# Altium project 手机滚压测试运动控制板.PrjPCB
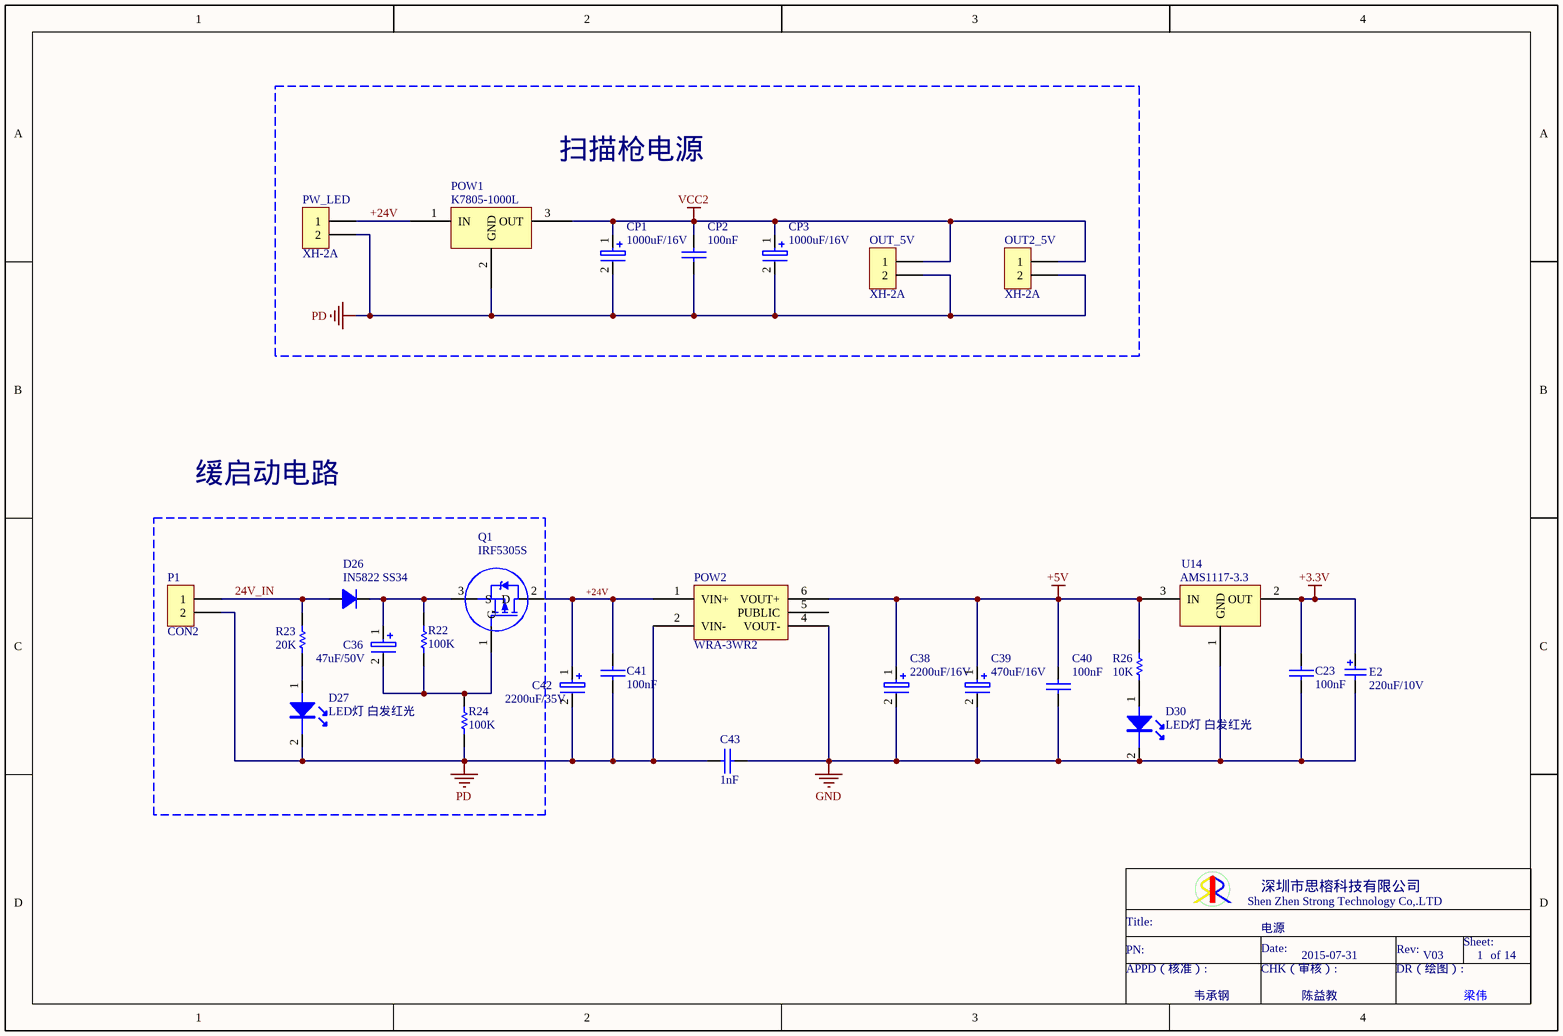
[diagram p0: 01_POWER.SchDoc]
14 sheets, 390 parts. Net scope: global (net labels, ports and power ports of the same name join across sheets).
Board file: 手机滚压测试夹具.PcbDoc
Sheets:
  01_POWER.SchDoc
  02_MCU.SchDoc
  03_USART.SchDoc
  04_SCAN.SchDoc
  05_SD_USB.SchDoc
  06_SENSOR.SchDoc
  07_MOTOR.SchDoc
  08_DC_DC.SchDoc
  09_AD.SchDoc
  10_AD1.SchDoc
  11_INPUT.SchDoc
  12_OUT.SchDoc
  13_EEPROM_SW_JTAG.SchDoc
  14_CONNECTOR.SchDoc

## Sheet 01_POWER.SchDoc
size A4; Date: 2015-08-03; PageSetup: Record=PageOptions|CenterHorizontal=True|CenterVertical=True|PrintScale=0.97|XCorrection=1.00|YCorrection=1.00|PrintKind=0|BorderSize=5000000|LeftOffset=0|BottomOffset=0|Orientation=2|PaperLength=1000|PaperWidth=1000|Scale=100|PaperSource=7|PrintQuality=-4|MediaType=1|DitherType=10|PaperKind=A4|PrintScaleMode=1

### Parts
C23  100nF  [0603C]
C36  47uF/50V  [RB6.3*11]
C38  2200uF/16V  [RB10*20]
C39  470uF/16V  [RB8*11.5]
C40  100nF  [0805C]
C41  100nF  [0805C]
C42  2200uF/35V  [RB16*25]
C43  1nF  [1206C]
CP1  1000uF/16V  [RB8*11.5]
CP2  100nF  [0805C]
CP3  1000uF/16V  [RB8*11.5]
D26  IN5822 SS34  [DO-214AA]
D27  LED灯 白发红光  [D0603]
D30  LED灯 白发红光  [D0603]
E2  220uF/10V  [6032]
OUT2_5V  XH-2A  [CN2-2.54]
OUT_5V  XH-2A  [CN2-2.54]
P1  CON2  [CON-2_5.08]
POW1  K7805-1000L  [K7805-1000L]
POW2  WRA-3WR2  [WRA-3WR2]
PW_LED  XH-2A  [CN2-2.54]
Q1  IRF5305S  [TO-252]
R22  100K  [0805R]
R23  20K  [0805R]
R24  100K  [0805R]
R26  10K  [0603R]
U14  AMS1117-3.3  [SOT223_CX1117]

### Blocks framed on the sheet
扫描枪电源: CP1-CP3 OUT2_5V OUT_5V POW1 PW_LED

### Nets
+3.3V: C23.2 E2.1 U14.2(OUT)
+5V: C38.1 C39.1 C40.1 POW2.6(VOUT+) R26.2 U14.3(IN)
+24V: C41.1 C42.1 POW1.1(IN) POW2.1(VIN+) PW_LED.1 Q1.2(D)
GND: C23.1 C38.2 C39.2 C40.2 C43.2 D30.2 E2.2 POW2.4(VOUT-) U14.1(GND)
PD: C41.2 C42.2 C43.1 CP1.2 CP2.2 CP3.2 D27.2 OUT2_5V.2 OUT_5V.2 P1.2 POW1.2(GND) POW2.2(VIN-) PW_LED.2 R24.1
VCC2: CP1.1 CP2.1 CP3.1 OUT2_5V.1 OUT_5V.1 POW1.3(OUT)
24V_IN: D26.1 P1.1 R23.2
NetC36_1: C36.1 D26.2 Q1.3(S) R22.2
NetC36_2: C36.2 Q1.1(G) R22.1 R24.2
NetD27_1: D27.1 R23.1
NetD30_1: D30.1 R26.1

Not connected (* = marked no-connect by the designer): POW2 5(PUBLIC)

### Notes on the sheet
- 缓启动电路
- 电源
- 2015-07-31
- V03
- 1
- 14
- 韦承钢
- 陈益教
- Shen Zhen Strong Technology Co,.LTD
- 深圳市思榕科技有限公司
- Title:
- PN:
- APPD（核准）:
- Date:
- CHK（审核）:
- DR（绘图）:
- Rev:
- Sheet:
- of
- 梁伟

### Library data of the parts
C23 = CAP
C36 C38 C39 C42 CP1 CP3 = CAP2: 电解电容器
C40 C41 C43 CP2 = CAP: Capacitor
D26 = DIODE-D
D27 D30 = LED: LED灯
E2 = 电解电容: Bi-Polar Capacitor; Value: 220uF/10V
OUT2_5V OUT_5V PW_LED = CON2
POW2 = Component_1
Q1 = MOSFET-P: P型MOSFET
R22-R24 R26 = RES
U14 = CX1117

## Sheet 02_MCU.SchDoc
size A4; PageSetup: Record=PageOptions|CenterHorizontal=True|CenterVertical=True|PrintScale=0.97|XCorrection=1.00|YCorrection=1.00|PrintKind=0|BorderSize=5000000|LeftOffset=0|BottomOffset=0|Orientation=2|PaperLength=1000|PaperWidth=1000|Scale=100|PaperSource=7|PrintQuality=-4|MediaType=1|DitherType=10|PaperKind=A4|PrintScaleMode=1; DATA: 2015-08-03
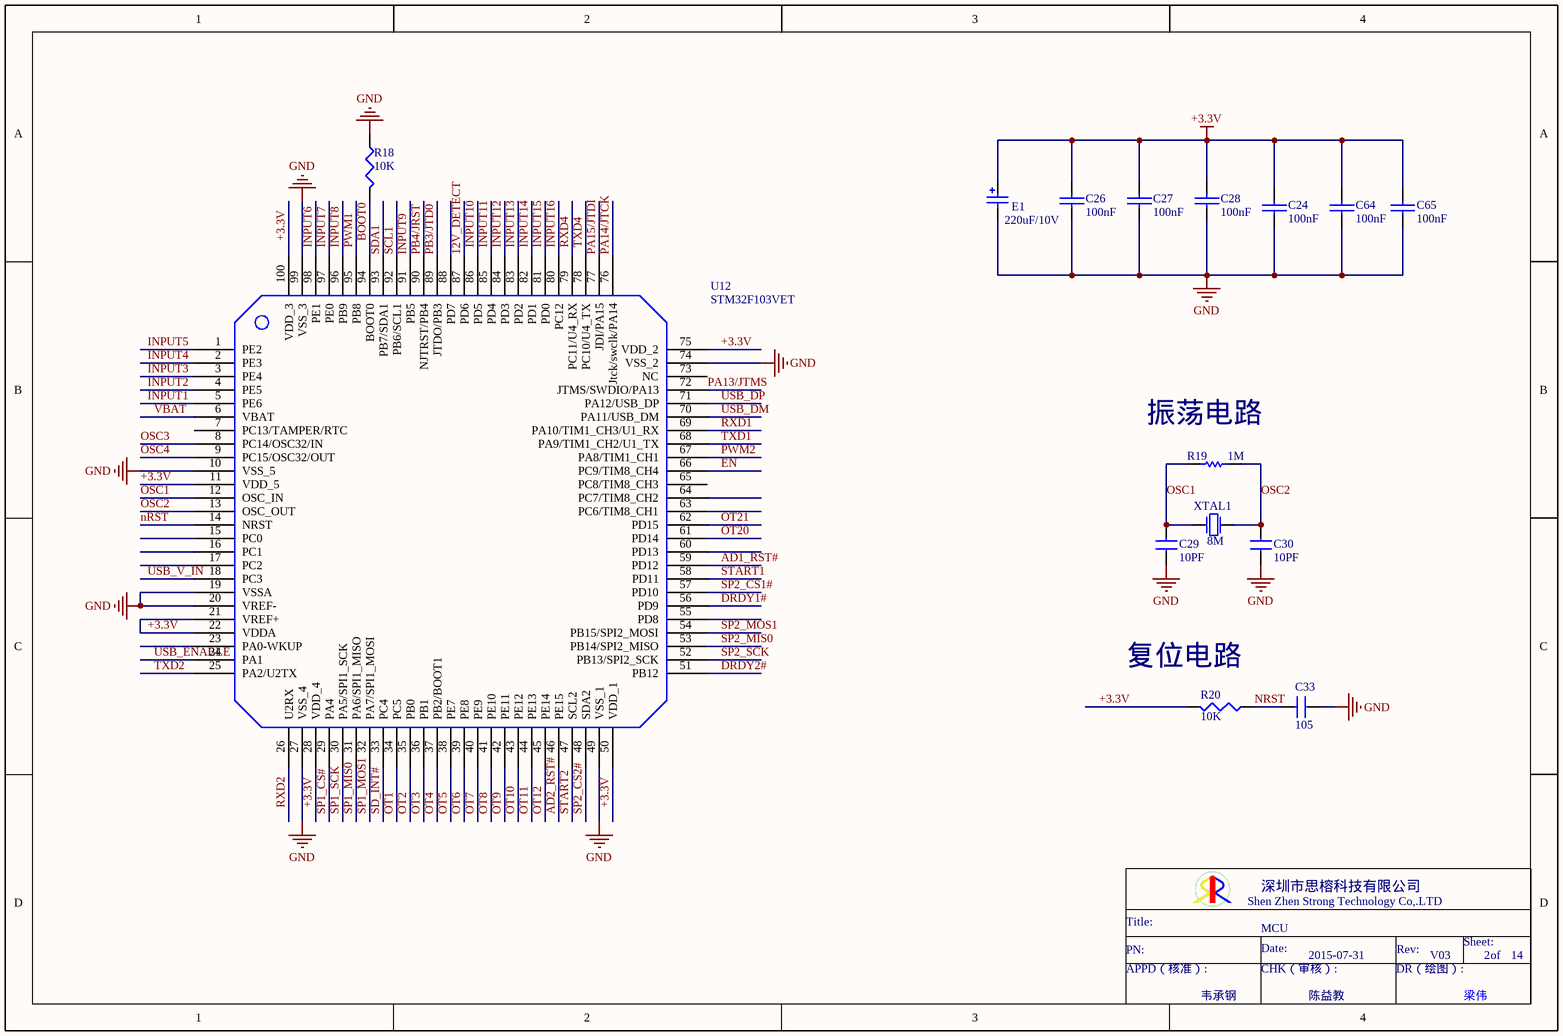
[diagram p1: 02_MCU.SchDoc]

### Parts
C24  100nF  [0603C]
C26  100nF  [0603C]
C27  100nF  [0603C]
C28  100nF  [0603C]
C29  10PF  [0603C]
C30  10PF  [0603C]
C33  value 105  [0603C]  (hidden comment: 100nF)
C64  100nF  [0603C]
C65  100nF  [0603C]
E1  220uF/10V  [6032]
R18  10K  [0603R]
R19  1M  [0603R]
R20  10K  [0603R]
U12  STM32F103VET  [LQFP100]
XTAL1  8M  [CRYL3*5]

### Nets
+3.3V: C24.2 C26.2 C27.2 C28.2 C64.2 C65.2 E1.1 R20.2 U12.11(VDD_5) U12.21(VREF+) U12.22(VDDA) U12.28(VDD_4) U12.50(VDD_1) U12.75(VDD_2) U12.100(VDD_3)
GND: C24.1 C26.1 C27.1 C28.1 C29.1 C30.1 C33.2 C64.1 C65.1 E1.2 R18.1 U12.10(VSS_5) U12.19(VSSA) U12.20(VREF-) U12.27(VSS_4) U12.49(VSS_1) U12.74(VSS_2) U12.99(VSS_3)
12V_DETECT: U12.87(PD6)
AD1_RST#: U12.59(PD12)
AD2_RST#: U12.46(PE15)
BOOT0: R18.2 U12.94(BOOT0)
DRDY1#: U12.56(PD9)
DRDY2#: U12.51(PB12)
EN: U12.66(PC9/TIM8_CH4)
INPUT1: U12.5(PE6)
INPUT2: U12.4(PE5)
INPUT3: U12.3(PE4)
INPUT4: U12.2(PE3)
INPUT5: U12.1(PE2)
INPUT6: U12.98(PE1)
INPUT7: U12.97(PE0)
INPUT8: U12.96(PB9)
INPUT9: U12.91(PB5)
INPUT10: U12.86(PD5)
INPUT11: U12.85(PD4)
INPUT12: U12.84(PD3)
INPUT13: U12.83(PD2)
INPUT14: U12.82(PD1)
INPUT15: U12.81(PD0)
INPUT16: U12.80(PC12)
nRST: C33.1 R20.1 U12.14(NRST)
OSC1: C29.2 R19.2 U12.12(OSC_IN) XTAL1.1
OSC2: C30.2 R19.1 U12.13(OSC_OUT) XTAL1.2
OSC3: U12.8(PC14/OSC32/IN)
OSC4: U12.9(PC15/OSC32/OUT)
OT1: U12.34(PC5)
OT2: U12.35(PB0)
OT3: U12.36(PB1)
OT4: U12.37(PB2/BOOT1)
OT5: U12.38(PE7)
OT6: U12.39(PE8)
OT7: U12.40(PE9)
OT8: U12.41(PE10)
OT9: U12.42(PE11)
OT10: U12.43(PE12)
OT11: U12.44(PE13)
OT12: U12.45(PE14)
OT20: U12.61(PD14)
OT21: U12.62(PD15)
PA13/JTMS: U12.72(JTMS/SWDIO/PA13)
PA14/JTCK: U12.76(Jtck/swclk/PA14)
PA15/JTDI: U12.77(JDI/PA15)
PB3/JTD0: U12.89(JTDO/PB3)
PB4/JRST: U12.90(NJTRST/PB4)
PWM1: U12.95(PB8)
PWM2: U12.67(PA8/TIM1_CH1)
RXD1: U12.69(PA10/TIM1_CH3/U1_RX)
RXD2: U12.26(U2RX)
RXD4: U12.79(PC11/U4_RX)
SCL1: U12.92(PB6/SCL1)
SD_INT#: U12.33(PC4)
SDA1: U12.93(PB7/SDA1)
SP1_CS#: U12.29(PA4)
SP1_MIS0: U12.31(PA6/SPI1_MISO)
SP1_MOS1: U12.32(PA7/SPI1_MOSI)
SP1_SCK: U12.30(PA5/SPI1_SCK)
SP2_CS1#: U12.57(PD10)
SP2_CS2#: U12.48(SDA2)
SP2_MIS0: U12.53(PB14/SPI2_MISO)
SP2_MOS1: U12.54(PB15/SPI2_MOSI)
SP2_SCK: U12.52(PB13/SPI2_SCK)
START1: U12.58(PD11)
START2: U12.47(SCL2)
TXD1: U12.68(PA9/TIM1_CH2/U1_TX)
TXD2: U12.25(PA2/U2TX)
TXD4: U12.78(PC10/U4_TX)
USB_DM: U12.70(PA11/USB_DM)
USB_DP: U12.71(PA12/USB_DP)
USB_ENABLE: U12.24(PA1)
USB_V_IN: U12.18(PC3)
VBAT: U12.6(VBAT)

Not connected (* = marked no-connect by the designer): U12 7(PC13/TAMPER/RTC) 15(PC0) 16(PC1) 17(PC2) 23(PA0-WKUP) 55(PD8) 60(PD13) 63(PC6/TIM8_CH1) 64(PC7/TIM8_CH2) 65(PC8/TIM8_CH3) 73(NC) 88(PD7)

### Notes on the sheet
- (near R19) 振荡电路
- (near R20) 复位电路
- MCU
- 2015-07-31
- V03
- 2
- 14
- 韦承钢
- 陈益教
- Shen Zhen Strong Technology Co,.LTD
- 深圳市思榕科技有限公司
- Title:
- PN:
- APPD（核准）:
- Date:
- CHK（审核）:
- DR（绘图）:
- Rev:
- Sheet:
- of
- 梁伟

### Library data of the parts
C24 C26-C28 C64 C65 = CAP
C29 C30 C33 = 电容: Capacitor
  C29 C30: Value: 10PF
E1 = 电解电容: Bi-Polar Capacitor; Value: 220uF/10V
R18 R20 = RES1
R19 = RES
U12 = STM32F103VET_1
XTAL1 = 晶振: CRYSTAL

## Sheet 03_USART.SchDoc
size A4; PageSetup: Record=PageOptions|CenterHorizontal=True|CenterVertical=True|PrintScale=0.97|XCorrection=1.00|YCorrection=1.00|PrintKind=0|BorderSize=5000000|LeftOffset=0|BottomOffset=0|Orientation=2|PaperLength=1000|PaperWidth=1000|Scale=100|PaperSource=7|PrintQuality=-4|MediaType=1|DitherType=10|PaperKind=A4|PrintScaleMode=1
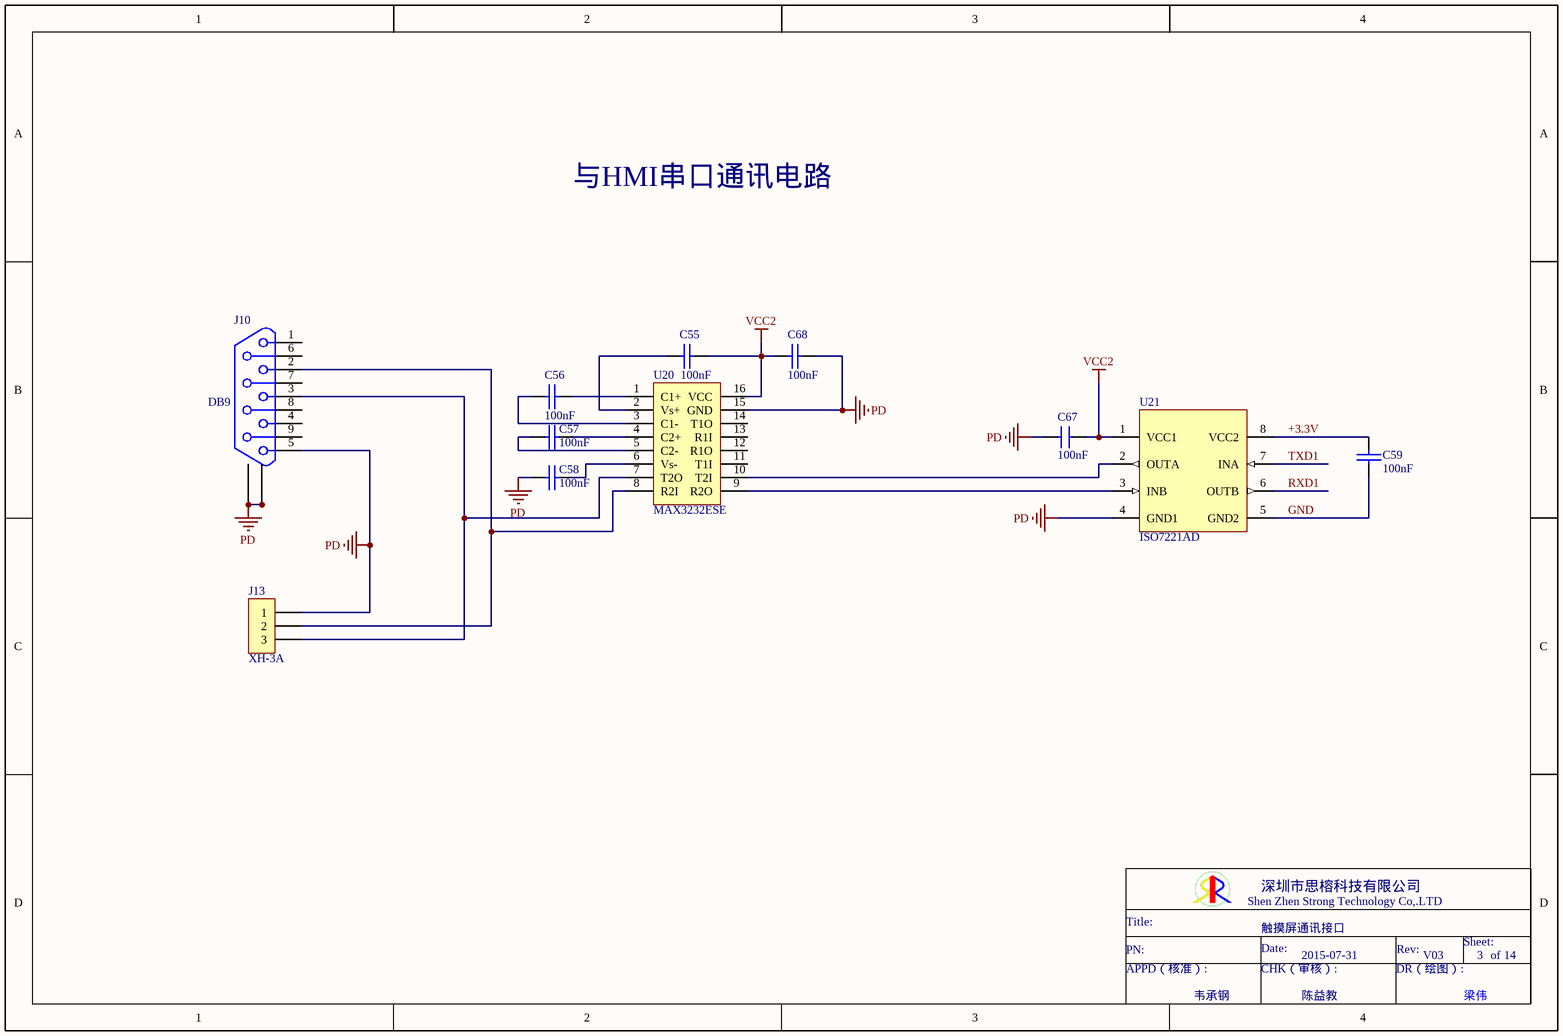
[diagram p2: 03_USART.SchDoc]

### Parts
C55  100nF  [0603C]
C56  100nF  [0603C]
C57  100nF  [0603C]
C58  100nF  [0603C]
C59  100nF  [0603C]
C67  100nF  [0603C]
C68  100nF  [0603C]
J10  DB9  [DSUB1.385]
J13  XH-3A  [CN3-2.54]
U20  MAX3232ESE  [SO-16]
U21  ISO7221AD  [SOP8]

### Nets
+3.3V: C59.2 U21.8(VCC2)
GND: C59.1 U21.5(GND2)
PD: C58.1 C67.1 C68.1 J10.5 J10.10 J10.11 J13.1 U20.15(GND) U21.4(GND1)
VCC2: C55.2 C67.2 C68.2 U20.16(VCC) U21.1(VCC1)
RXD1: U21.6(OUTB)
TXD1: U21.7(INA)
NetC55_1: C55.1 U20.2(Vs+)
NetC56_1: C56.1 U20.1(C1+)
NetC56_2: C56.2 U20.3(C1-)
NetC57_1: C57.1 U20.5(C2-)
NetC57_2: C57.2 U20.4(C2+)
NetC58_2: C58.2 U20.6(Vs-)
NetJ10_2: J10.2 J13.2 U20.8(R2I)
NetJ10_3: J10.3 J13.3 U20.7(T2O)
NetU20_9: U20.9(R2O) U21.3(INB)
NetU20_10: U20.10(T2I) U21.2(OUTA)

Not connected (* = marked no-connect by the designer): J10 1 4 6 7 8 9; U20 11(T1I) 12(R1O) 13(R1I) 14(T1O)

### Notes on the sheet
- 与HMI串口通讯电路
- 触摸屏通讯接口
- 2015-07-31
- V03
- 3
- 14
- 韦承钢
- 陈益教
- Shen Zhen Strong Technology Co,.LTD
- 深圳市思榕科技有限公司
- Title:
- PN:
- APPD（核准）:
- Date:
- CHK（审核）:
- DR（绘图）:
- Rev:
- Sheet:
- of
- 梁伟

### Library data of the parts
C55-C59 C68 = CAP
C67 = 电容: Capacitor; C318: 100NF
J13 = CON3
U20 = MAX232
U21 = Component_1

## Sheet 04_SCAN.SchDoc
size A4; PageSetup: Record=PageOptions|CenterHorizontal=True|CenterVertical=True|PrintScale=0.97|XCorrection=1.00|YCorrection=1.00|PrintKind=0|BorderSize=5000000|LeftOffset=0|BottomOffset=0|Orientation=2|PaperLength=1000|PaperWidth=1000|Scale=100|PaperSource=7|PrintQuality=-4|MediaType=1|DitherType=10|PaperKind=A4|PrintScaleMode=1
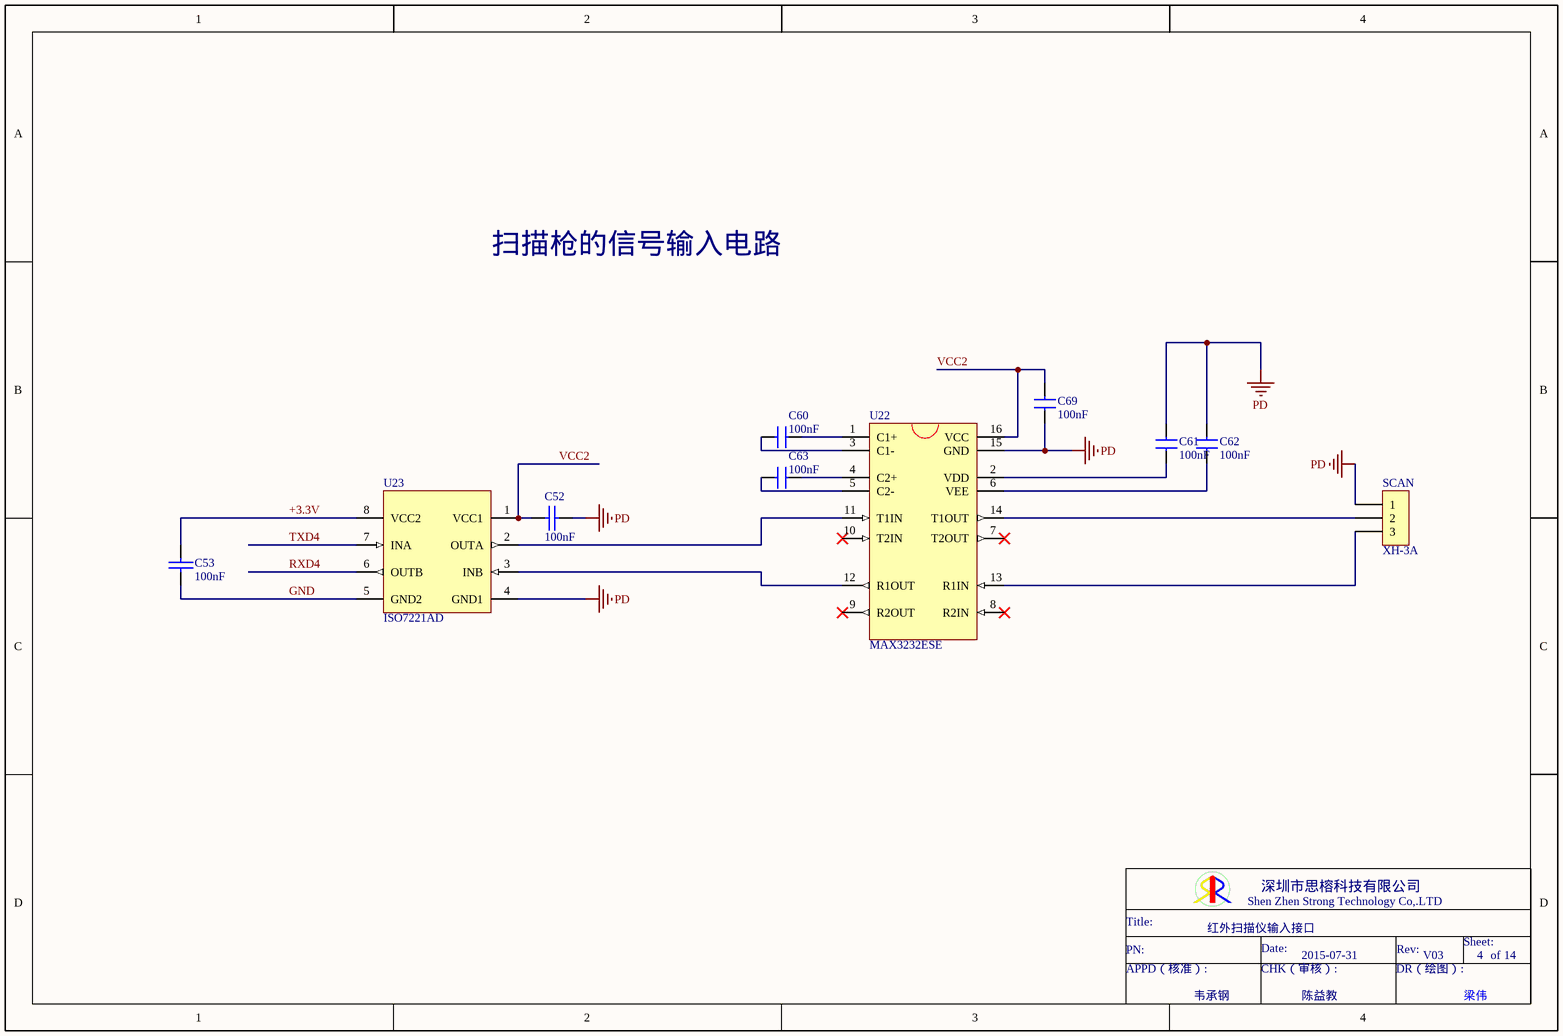
[diagram p3: 04_SCAN.SchDoc]

### Parts
C52  100nF  [0603C]
C53  100nF  [0603C]
C60  100nF  [0603C]
C61  100nF  [0603C]
C62  100nF  [0603C]
C63  100nF  [0603C]
C69  100nF  [0603C]
SCAN  XH-3A  [CN3-2.54]
U22  MAX3232ESE  [SOP16]
U23  ISO7221AD  [SOP8]

### Nets
+3.3V: C53.2 U23.8(VCC2)
GND: C53.1 U23.5(GND2)
PD: C52.2 C61.2 C62.2 C69.2 SCAN.1 U22.15(GND) U23.4(GND1)
VCC2: C52.1 C69.1 U22.16(VCC) U23.1(VCC1)
RXD4: U23.6(OUTB)
TXD4: U23.7(INA)
NetC60_1: C60.1 U22.3(C1-)
NetC60_2: C60.2 U22.1(C1+)
NetC61_1: C61.1 U22.2(VDD)
NetC62_1: C62.1 U22.6(VEE)
NetC63_1: C63.1 U22.4(C2+)
NetC63_2: C63.2 U22.5(C2-)
NetSCAN_2: SCAN.2 U22.14(T1OUT)
NetSCAN_3: SCAN.3 U22.13(R1IN)
NetU22_11: U22.11(T1IN) U23.2(OUTA)
NetU22_12: U22.12(R1OUT) U23.3(INB)

Not connected (* = marked no-connect by the designer): U22 7(T2OUT)* 8(R2IN)* 9(R2OUT)* 10(T2IN)*

### Notes on the sheet
- 扫描枪的信号输入电路
- 红外扫描仪输入接口
- 2015-07-31
- V03
- 4
- 14
- 韦承钢
- 陈益教
- Shen Zhen Strong Technology Co,.LTD
- 深圳市思榕科技有限公司
- Title:
- PN:
- APPD（核准）:
- Date:
- CHK（审核）:
- DR（绘图）:
- Rev:
- Sheet:
- of
- 梁伟

### Library data of the parts
C52 C53 = CAP
C60-C63 C69 = 电容: Capacitor
  C60: C316: 100NF
  C61: C319: 100NF
  C62: C320: 100NF
  C63: C317: 100NF
  C69: C318: 100NF
SCAN = CON3
U22 = U101: SP3232; Published: 8-Jun-2000; LatestRevisionDate: 29-May-2009; LatestRevisionNote: IPC-7351 Footprint Added.; PackageVersion: Aug-1999; PackageReference: SOT-23B; Publisher: Altium Limited; PackageDescription: 3-Pin SOT-23 Package 0.95 mm Pitch, 2.4 mm Lead Span
U23 = Component_1

## Sheet 05_SD_USB.SchDoc
size A4; PageSetup: Record=PageOptions|CenterHorizontal=True|CenterVertical=True|PrintScale=0.97|XCorrection=1.00|YCorrection=1.00|PrintKind=0|BorderSize=5000000|LeftOffset=0|BottomOffset=0|Orientation=2|PaperLength=1000|PaperWidth=1000|Scale=100|PaperSource=7|PrintQuality=-4|MediaType=1|DitherType=10|PaperKind=A4|PrintScaleMode=1
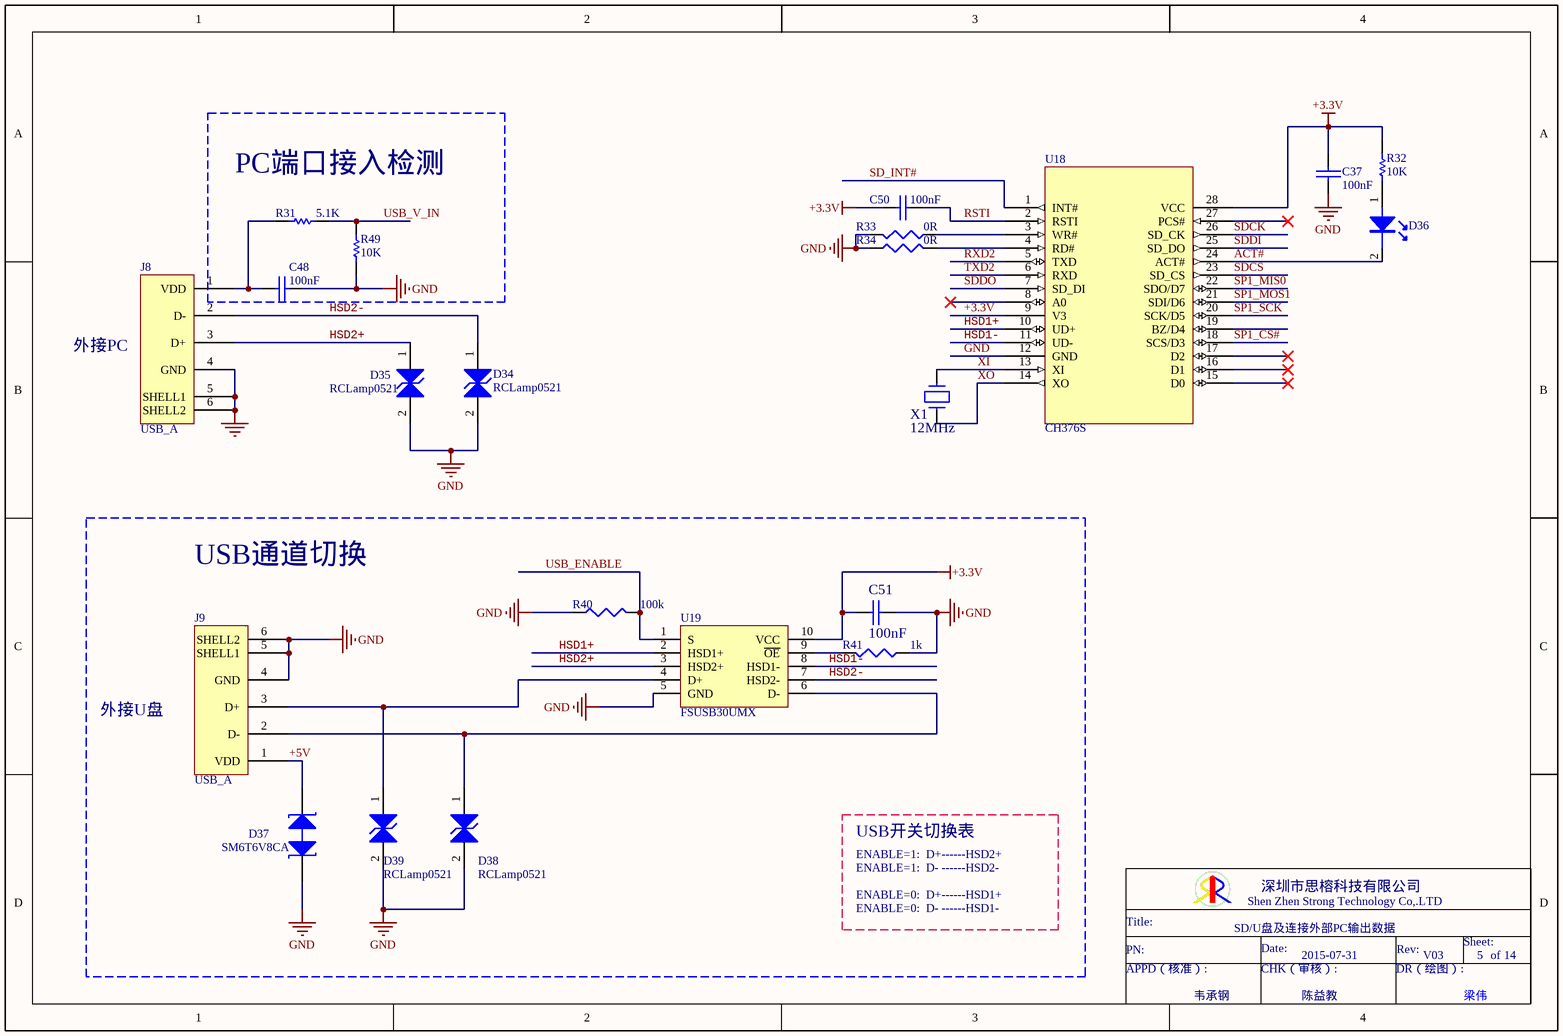
[diagram p4: 05_SD_USB.SchDoc]

### Parts
C37  100nF  [0603C]
C48  100nF  [0603C]
C50  100nF  [0603C]
C51  100nF  [0603C]
D34  RCLamp0521  [TVS]
D35  RCLamp0521  [TVS]
D36  LED灯 白发红光  [D0603]  (value not drawn)
D37  SM6T6V8CA  [DO-214AA]
D38  RCLamp0521  [TVS]
D39  RCLamp0521  [TVS]
J8  USB_A  [USB-AF]
J9  USB_A  [USB-AF]
R31  5.1K  [0603R]
R32  10K  [0603R]
R33  0R  [0603R]
R34  0R  [0603R]
R40  100k  [0603R]
R41  1k  [0603R]
R49  10K  [0603R]
U18  CH376S  [SOP28]
U19  FSUSB30UMX  [SSOP10]
X1  12MHz  [CRYL3*5]

### Blocks framed on the sheet
PC端口接入检测: C48 R31 R49
USB通道切换: C51 D37-D39 J9 R40 R41 U19

### Nets
+3.3V: C37.1 C50.1 C51.1 R32.2 U18.9(V3) U18.28(VCC) U19.10(VCC)
+5V: D37.2 J9.1(VDD)
GND: C37.2 C48.2 C51.2 D34.2 D35.2 D37.1 D38.2 D39.2 J8.4(GND) J8.5(SHELL1) J8.6(SHELL2) J9.4(GND) J9.5(SHELL1) J9.6(SHELL2) R33.2 R34.1 R40.1 R41.1 R49.2 U18.12(GND) U19.5(GND)
ACT#: D36.2 U18.24(ACT#)
HSD1+: U18.10(UD+) U19.2(HSD1+)
HSD1-: U18.11(UD-) U19.8(HSD1-)
HSD2+: D35.1 J8.3(D+) U19.3(HSD2+)
HSD2-: D34.1 J8.2(D-) U19.7(HSD2-)
RSTI: C50.2 U18.2(RSTI)
RXD2: U18.5(TXD)
SD_INT#: U18.1(INT#)
SDCK: U18.26(SD_CK)
SDCS: U18.23(SD_CS)
SDDI: U18.25(SD_DO)
SDDO: U18.7(SD_DI)
SP1_CS#: U18.18(SCS/D3)
SP1_MIS0: U18.22(SDO/D7)
SP1_MOS1: U18.21(SDI/D6)
SP1_SCK: U18.20(SCK/D5)
TXD2: U18.6(RXD)
USB_ENABLE: R40.2 U19.1(S)
USB_V_IN: R31.2 R49.1
XI: U18.13(XI) X1.1
XO: U18.14(XO) X1.2
NetC48_1: C48.1 J8.1(VDD) R31.1
NetD36_1: D36.1 R32.1
NetD38_1: D38.1 J9.2(D-) U19.6(D-)
NetD39_1: D39.1 J9.3(D+) U19.4(D+)
NetR33_1: R33.1 U18.3(WR#)
NetR34_2: R34.2 U18.4(RD#)
NetR41_2: R41.2 U19.9(~{OE})

Not connected (* = marked no-connect by the designer): U18 8(A0)* 15(D0)* 16(D1)* 17(D2)* 19(BZ/D4) 27(PCS#)*

### Notes on the sheet
- 外接PC
- 外接U盘
- USB开关切换表
- ENABLE=1:  D+------HSD2+
- ENABLE=1:  D- ------HSD2-
- ENABLE=0:  D+------HSD1+
- ENABLE=0:  D- ------HSD1-
- SD/U盘及连接外部PC输出数据
- 2015-07-31
- V03
- 5
- 14
- 韦承钢
- 陈益教
- Shen Zhen Strong Technology Co,.LTD
- 深圳市思榕科技有限公司
- Title:
- PN:
- APPD（核准）:
- Date:
- CHK（审核）:
- DR（绘图）:
- Rev:
- Sheet:
- of
- 梁伟

### Library data of the parts
C37 C48 C50 = CAP: Capacitor
C51 = Pro7B.tmp_0.01u_17
D34 D35 D38 D39 = TVS: RCLamp0521   SEMTECH; Published: 8-Jun-2000; LatestRevisionDate: 29-May-2009; LatestRevisionNote: IPC-7351 Footprint Added.; PackageVersion: Aug-1999; PackageReference: SOT-23B; Publisher: Altium Limited; PackageDescription: 3-Pin SOT-23 Package 0.95 mm Pitch, 2.4 mm Lead Span
D36 = LED: LED灯
D37 = TVS-1: SM6T6V8CA  ST; Published: 8-Jun-2000; LatestRevisionDate: 29-May-2009; LatestRevisionNote: IPC-7351 Footprint Added.; PackageVersion: Aug-1999; PackageReference: SOT-23B; Publisher: Altium Limited; PackageDescription: 3-Pin SOT-23 Package 0.95 mm Pitch, 2.4 mm Lead Span
J8 J9 = USB
R31 R32 R49 = RES
R33 = RES1: R1219: 0
R34 = RES1: R511: 0
R40 R41 = RES1
U18 = CH376S: USB Host and SD card Host with File System & USB Device for MCU, parallel / SPI / UART Serial
U19 = FSUSB30UMX_1: USB开关
X1 = Pro7B.tmp_12MHz_19

## Sheet 06_SENSOR.SchDoc
size A4; PageSetup: Record=PageOptions|CenterHorizontal=True|CenterVertical=True|PrintScale=0.97|XCorrection=1.00|YCorrection=1.00|PrintKind=0|BorderSize=5000000|LeftOffset=0|BottomOffset=0|Orientation=2|PaperLength=1000|PaperWidth=1000|Scale=100|PaperSource=7|PrintQuality=-4|MediaType=1|DitherType=10|PaperKind=A4|PrintScaleMode=1
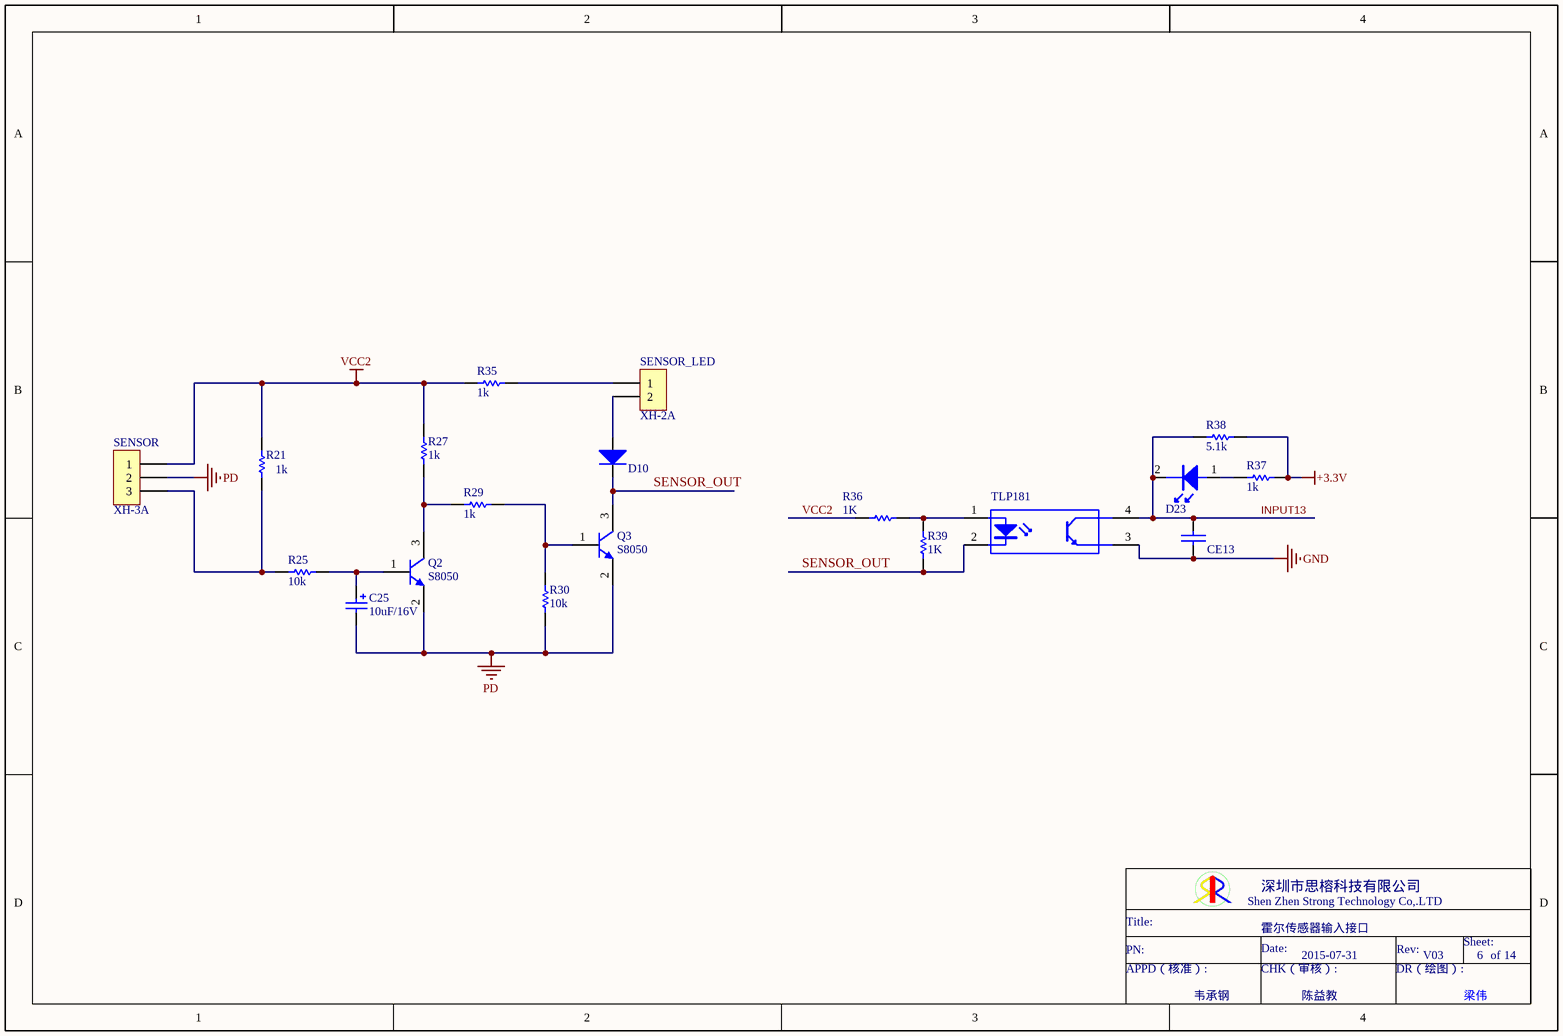
[diagram p5: 06_SENSOR.SchDoc]

### Parts
C25  10uF/16V  [A]
CE13  100pF  [0603C]  (value not drawn)
D10  IN4148W T4  [1206D]  (value not drawn)
D23  LED灯 白发红光  [D0603]  (value not drawn)
Q2  S8050  [SOT23]
Q3  S8050  [SOT23]
R21  1k  [0603R]
R25  10k  [0603R]
R27  1k  [0603R]
R29  1k  [0603R]
R30  10k  [0603R]
R35  1k  [0603R]
R36  1K  [0805R]
R37  1k  [0603R]
R38  5.1k  [0603R]
R39  1K  [0603R]
SENSOR  XH-3A  [CN3-2.54]
SENSOR_LED  XH-2A  [CN2-2.54]
U16  TLP181  [SOP4-2.54]

### Nets
+3.3V: R37.1 R38.1
GND: CE13.2 U16.3(E)
PD: C25.2 Q2.2(E) Q3.2(E) R30.1 SENSOR.2
VCC2: R21.1 R27.2 R35.1 R36.2 SENSOR.1
INPUT13: CE13.1 D23.2 R38.2 U16.4(C)
SENSOR_OUT: D10.2 Q3.3(C) R39.2 U16.2(K)
NetC25_1: C25.1 Q2.1(B) R25.1
NetD10_1: D10.1 SENSOR_LED.2
NetD23_1: D23.1 R37.2
NetQ2_3: Q2.3(C) R27.1 R29.2
NetQ3_1: Q3.1(B) R29.1 R30.2
NetR21_2: R21.2 R25.2 SENSOR.3
NetR35_2: R35.2 SENSOR_LED.1
NetR36_1: R36.1 R39.1 U16.1(A)

### Notes on the sheet
- 霍尔传感器输入接口
- 2015-07-31
- V03
- 6
- 14
- 韦承钢
- 陈益教
- Shen Zhen Strong Technology Co,.LTD
- 深圳市思榕科技有限公司
- Title:
- PN:
- APPD（核准）:
- Date:
- CHK（审核）:
- DR（绘图）:
- Rev:
- Sheet:
- of
- 梁伟

### Library data of the parts
C25 = Cap Pol2: Polarized Capacitor (Axial); Value: 100pF; Published: 8-Jun-2000; LatestRevisionDate: 17-Jul-2002; LatestRevisionNote: Re-released for DXP Platform.; PackageReference: POLAR0.8; Publisher: Altium Limited
CE13 = CAP: Capacitor
D10 = D: 二极管
D23 = LED: LED灯
Q2 Q3 = QNPN: NPN Bipolar Transistor; Published: 8-Jun-2000; LatestRevisionDate: 17-Jul-2002; LatestRevisionNote: Re-released for DXP Platform.; PackageReference: SOT-23B; Publisher: Altium Limited; Code_JEDEC: SOT-23
R21 R25 R27 R29 R30 R35-R39 = RES
SENSOR = CON3
SENSOR_LED = CON2
U16 = TLP521

## Sheet 07_MOTOR.SchDoc
size A4; PageSetup: Record=PageOptions|CenterHorizontal=True|CenterVertical=True|PrintScale=0.97|XCorrection=1.00|YCorrection=1.00|PrintKind=0|BorderSize=5000000|LeftOffset=0|BottomOffset=0|Orientation=2|PaperLength=1000|PaperWidth=1000|Scale=100|PaperSource=7|PrintQuality=-4|MediaType=1|DitherType=10|PaperKind=A4|PrintScaleMode=1
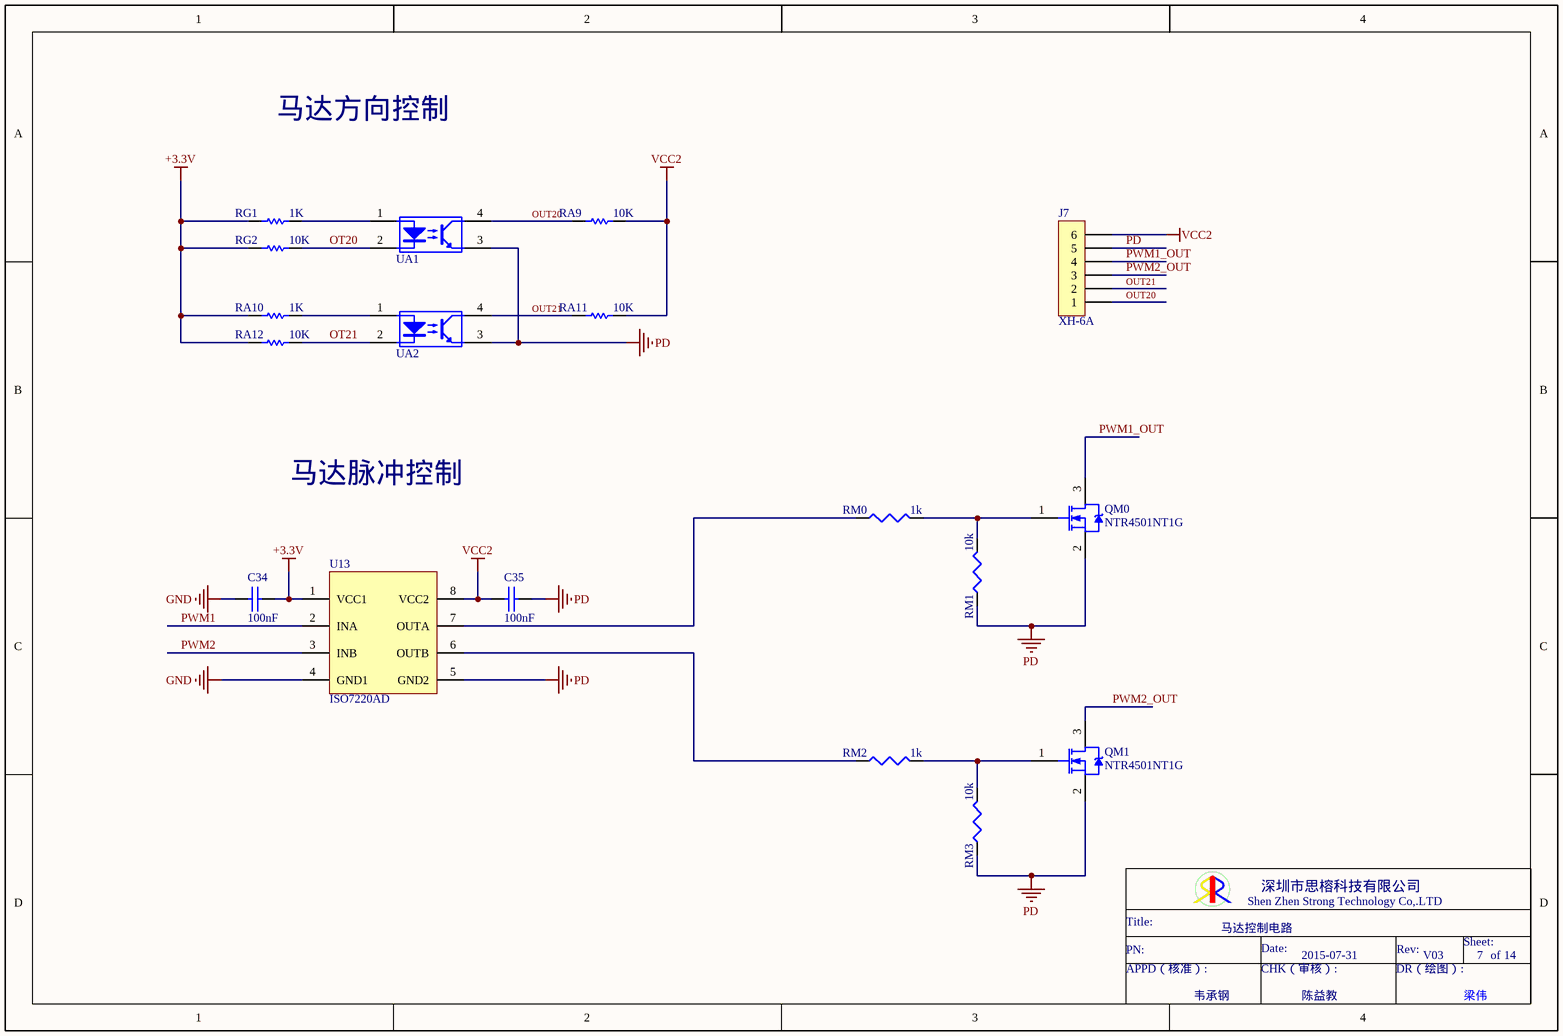
[diagram p6: 07_MOTOR.SchDoc]

### Parts
C34  100nF  [0603C]
C35  100nF  [0603C]
J7  XH-6A  [CN6-2.54]
QM0  NTR4501NT1G  [SOT23]
QM1  NTR4501NT1G  [SOT23]
RA9  10K  [0603R]
RA10  1K  [0603R]
RA11  10K  [0603R]
RA12  10K  [0603R]
RG1  1K  [0603R]
RG2  10K  [0603R]
RM0  1k  [0603R]
RM1  10k  [0603R]
RM2  1k  [0603R]
RM3  10k  [0603R]
U13  ISO7220AD  [SOP8]
UA1  AQY212GS  [SOP4-2.54]  (value not drawn)
UA2  AQY212GS  [SOP4-2.54]  (value not drawn)

### Nets
+3.3V: C34.2 RA10.1 RA12.1 RG1.1 RG2.1 U13.1(VCC1)
GND: C34.1 U13.4(GND1)
PD: C35.1 J7.5 QM0.2(S) QM1.2(S) RM1.1 RM3.1 U13.5(GND2) UA1.3(Emitter) UA2.3(Emitter)
VCC2: C35.2 J7.6 RA9.2 RA11.2 U13.8(VCC2)
OT20: RG2.2 UA1.2(LED_Cathode)
OT21: RA12.2 UA2.2(LED_Cathode)
OUT20: J7.1 RA9.1 UA1.4(Collector)
OUT21: J7.2 RA11.1 UA2.4(Collector)
PWM1: U13.2(INA)
PWM1_OUT: J7.4 QM0.3(D)
PWM2: U13.3(INB)
PWM2_OUT: J7.3 QM1.3(D)
NetQM0_1: QM0.1(G) RM0.2 RM1.2
NetQM1_1: QM1.1(G) RM2.2 RM3.2
NetRA10_2: RA10.2 UA2.1(LED_Anode)
NetRG1_2: RG1.2 UA1.1(LED_Anode)
NetRM0_1: RM0.1 U13.7(OUTA)
NetRM2_1: RM2.1 U13.6(OUTB)

### Notes on the sheet
- 马达方向控制
- 马达脉冲控制
- 马达控制电路
- 2015-07-31
- V03
- 7
- 14
- 韦承钢
- 陈益教
- Shen Zhen Strong Technology Co,.LTD
- 深圳市思榕科技有限公司
- Title:
- PN:
- APPD（核准）:
- Date:
- CHK（审核）:
- DR（绘图）:
- Rev:
- Sheet:
- of
- 梁伟

### Library data of the parts
C34 C35 = CAP
J7 = CON6: 单排
QM0 QM1 = MOSFET-N: MOSFET N沟道
RA9-RA12 RG1 RG2 = RES
RM0-RM3 = RES1
U13 = ISO7220: DUAL DIGITAL ISOLATOR
UA1 UA2 = TLP281

## Sheet 08_DC_DC.SchDoc
size A4; PageSetup: Record=PageOptions|CenterHorizontal=True|CenterVertical=True|PrintScale=0.97|XCorrection=1.00|YCorrection=1.00|PrintKind=0|BorderSize=5000000|LeftOffset=0|BottomOffset=0|Orientation=2|PaperLength=1000|PaperWidth=1000|Scale=100|PaperSource=7|PrintQuality=-4|MediaType=1|DitherType=10|PaperKind=A4|PrintScaleMode=1
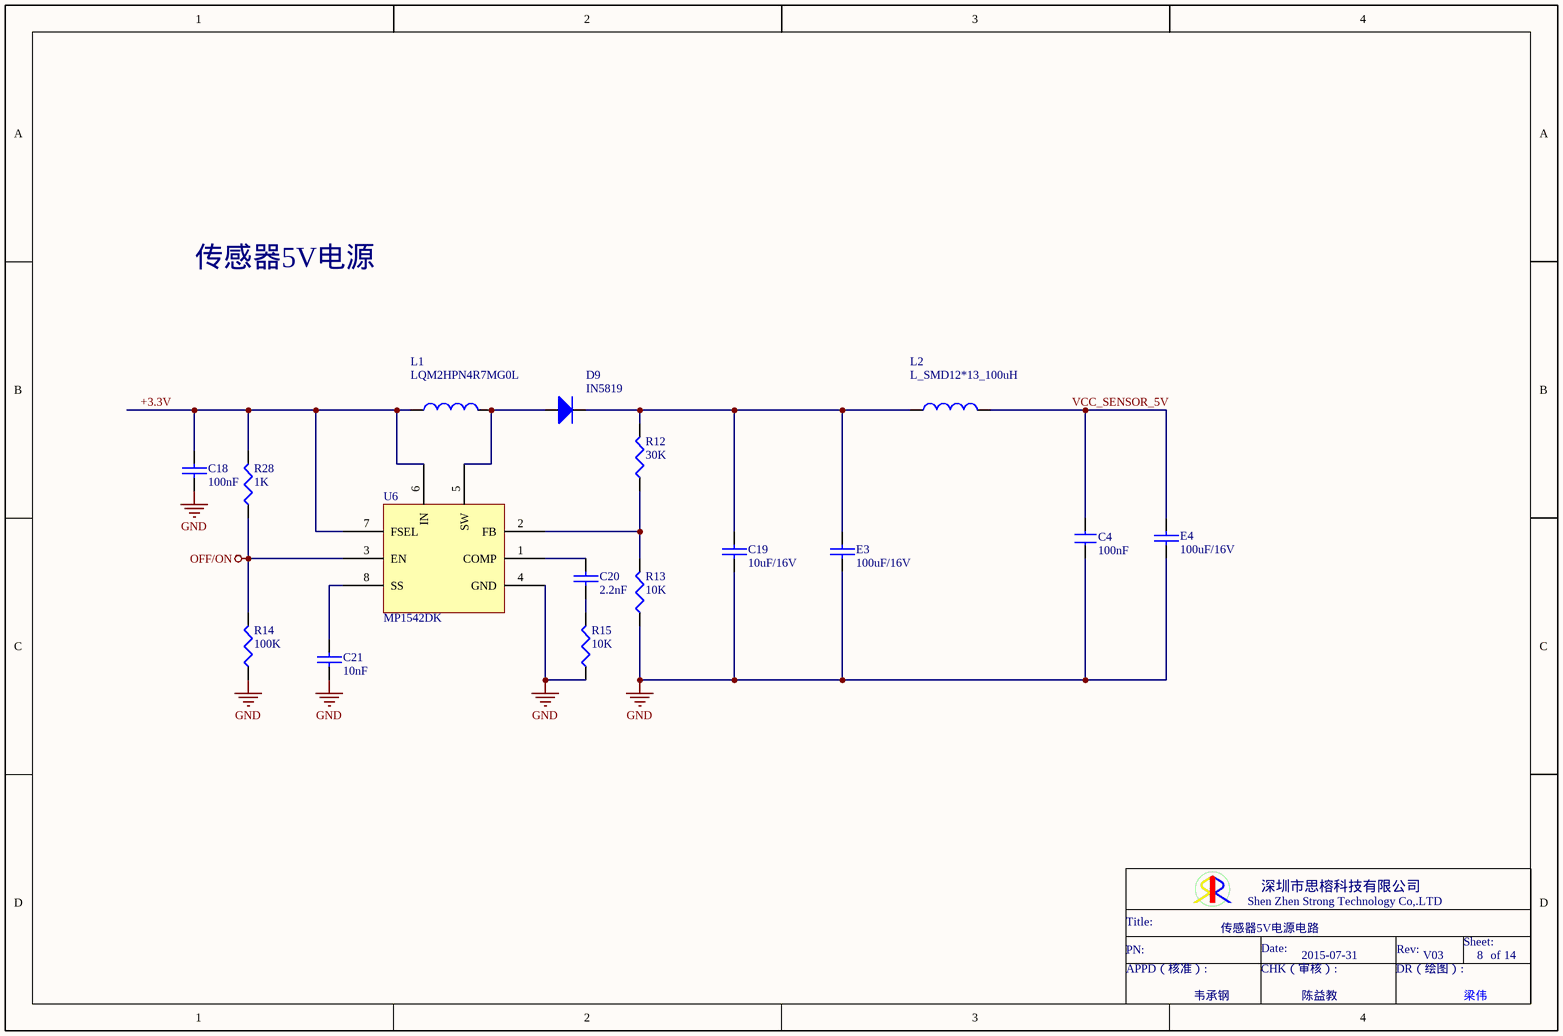
[diagram p7: 08_DC_DC.SchDoc]

### Parts
C4  100nF  [0603C]
C18  100nF  [0603C]
C19  10uF/16V  [A]
C20  2.2nF  [0603C]
C21  10nF  [0603C]
D9  IN5819  [1206D]
E3  100uF/16V  [6032]
E4  100uF/16V  [6032]
L1  LQM2HPN4R7MG0L  [3225]
L2  L_SMD12*13_100uH  [L-SMD12*13]
R12  30K  [0603R]
R13  10K  [0603R]
R14  100K  [0603R]
R15  10K  [0603R]
R28  1K  [0603R]
U6  MP1542DK  [SSOP8]

### Nets
+3.3V: C18.1 L1.1 R28.2 U6.6(IN) U6.7(FSEL)
GND: C4.2 C18.2 C19.2 C21.2 E3.2 E4.2 R13.1 R14.1 R15.1 U6.4(GND)
OFF/ON: R14.2 R28.1 U6.3(EN)
VCC_SENSOR_5V: C4.1 E4.1 L2.2
NetC19_1: C19.1 D9.2 E3.1 L2.1 R12.2
NetC20_1: C20.1 U6.1(COMP)
NetC20_2: C20.2 R15.2
NetC21_1: C21.1 U6.8(SS)
NetD9_1: D9.1 L1.2 U6.5(SW)
NetR12_1: R12.1 R13.2 U6.2(FB)

### Notes on the sheet
- 传感器5V电源
- 传感器5V电源电路
- 2015-07-31
- V03
- 8
- 14
- 韦承钢
- 陈益教
- Shen Zhen Strong Technology Co,.LTD
- 深圳市思榕科技有限公司
- Title:
- PN:
- APPD（核准）:
- Date:
- CHK（审核）:
- DR（绘图）:
- Rev:
- Sheet:
- of
- 梁伟

### Library data of the parts
C4 = 电容: Capacitor; Value: 100nF
C18-C21 E3 E4 = CAP: Capacitor
D9 = D: 二极管
L1 L2 = Inductor: Code_IEC: 1005; Value: 4.7uH; Published: 8-Jun-2000; LatestRevisionDate: 29-May-2009; LatestRevisionNote: IPC-7351 Footprint Added.; PackageReference: 0402-A; Publisher: Altium Limited; PackageDescription: Chip Inductor; Code_JEITA: 0402
R12-R15 R28 = RES1
U6 = MP1542DK: MPS公司产品   DC-DC控制IC; Published: 8-Jun-2000; LatestRevisionDate: 29-May-2009; LatestRevisionNote: IPC-7351 Footprint Added.; PackageVersion: Aug-1999; PackageReference: SOT-23B; Publisher: Altium Limited; PackageDescription: 3-Pin SOT-23 Package 0.95 mm Pitch, 2.4 mm Lead Span

## Sheet 09_AD.SchDoc
size A4; PageSetup: Record=PageOptions|CenterHorizontal=True|CenterVertical=True|PrintScale=0.97|XCorrection=1.00|YCorrection=1.00|PrintKind=0|BorderSize=5000000|LeftOffset=0|BottomOffset=0|Orientation=2|PaperLength=1000|PaperWidth=1000|Scale=100|PaperSource=7|PrintQuality=-4|MediaType=1|DitherType=10|PaperKind=A4|PrintScaleMode=1
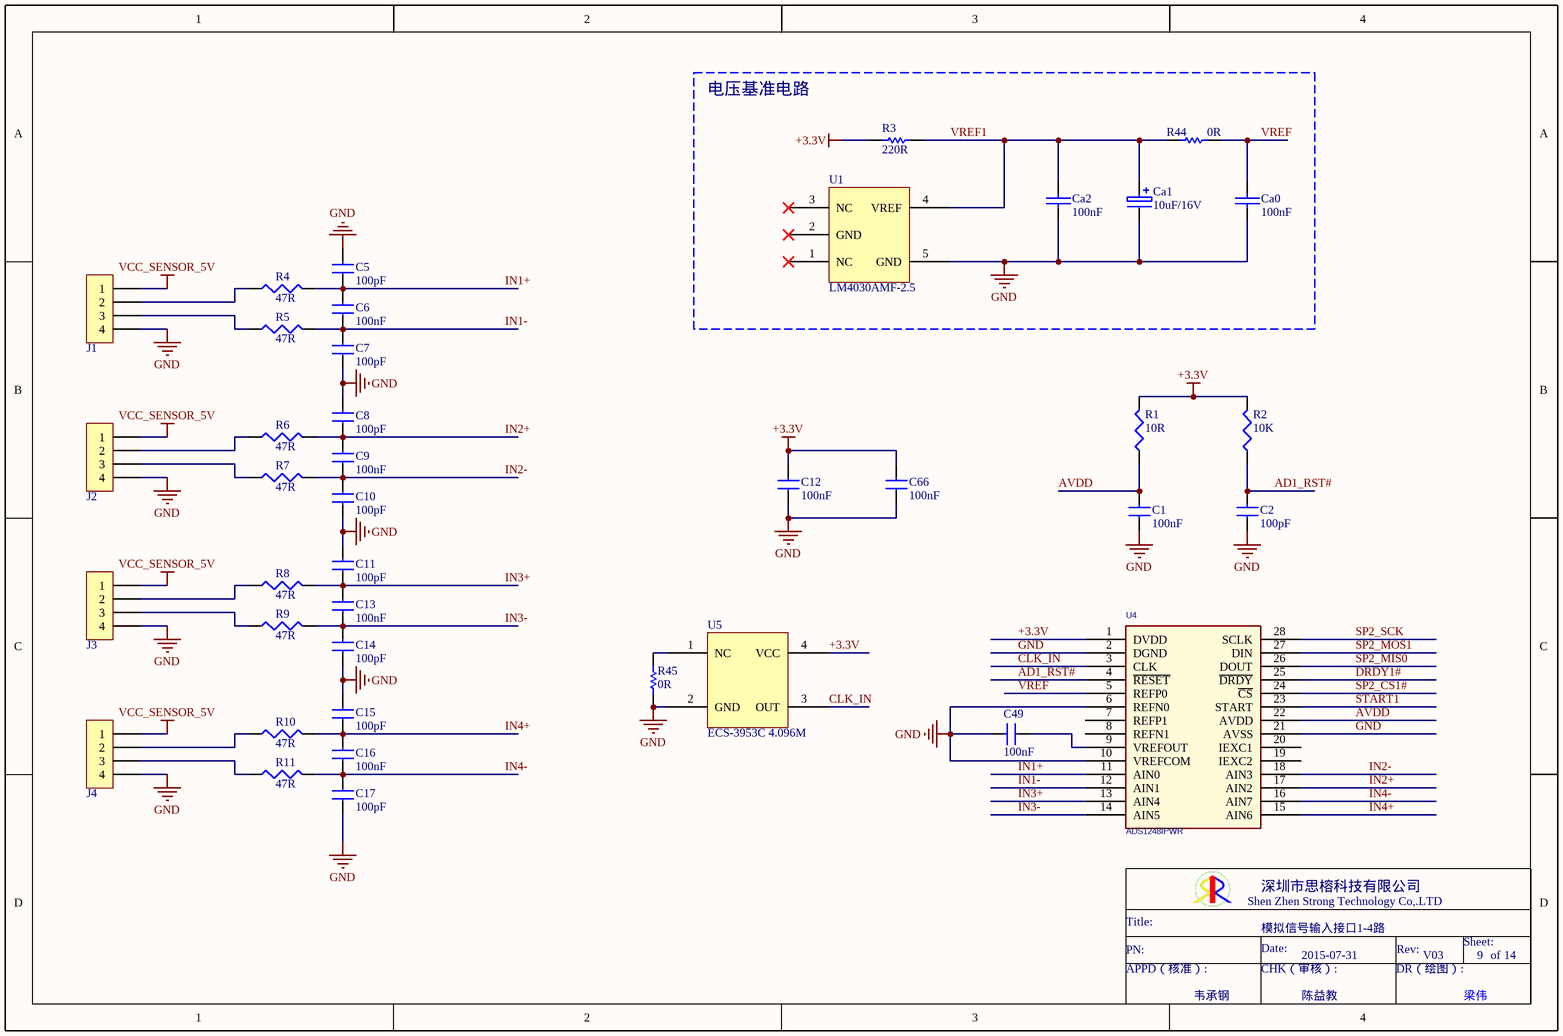
[diagram p8: 09_AD.SchDoc]

### Parts
C1  100nF  [0603C]
C2  100pF  [0603C]
C5  100pF  [0603C]
C6  100nF  [0603C]
C7  100pF  [0603C]
C8  100pF  [0603C]
C9  100nF  [0603C]
C10  100pF  [0603C]
C11  100pF  [0603C]
C12  100nF  [0603C]
C13  100nF  [0603C]
C14  100pF  [0603C]
C15  100pF  [0603C]
C16  100nF  [0603C]
C17  100pF  [0603C]
C49  100nF  [0603C]
C66  100nF  [0603C]
Ca0  100nF  [0603C]
Ca1  10uF/16V  [A]
Ca2  100nF  [0603C]
J1  XH-4A  [CN4-2.54]  (value not drawn)
J2  XH-4A  [CN4-2.54]  (value not drawn)
J3  XH-4A  [CN4-2.54]  (value not drawn)
J4  XH-4A  [CN4-2.54]  (value not drawn)
R1  10R  [0603R]
R2  10K  [0603R]
R3  220R  [0603R]
R4  47R  [0603R]
R5  47R  [0603R]
R6  47R  [0603R]
R7  47R  [0603R]
R8  47R  [0603R]
R9  47R  [0603R]
R10  47R  [0603R]
R11  47R  [0603R]
R44  0R  [0603R]
R45  0R  [0603R]
U1  LM4030AMF-2.5  [SOT23-5]
U4  ADS1248IPWR  [SOIC28]
U5  ECS-3953C 4.096M  [ECS-3953C]

### Blocks framed on the sheet
电压基准电路: Ca0-Ca2 R3 R44 U1

### Nets
+3.3V: C12.1 C66.2 R1.2 R2.2 R3.2 U4.1(DVDD) U5.4(VCC)
GND: C1.2 C2.2 C5.1 C7.2 C8.1 C10.2 C11.1 C12.2 C14.2 C15.1 C17.2 C49.2 C66.1 Ca0.2 Ca1.2 Ca2.2 J1.4 J2.4 J3.4 J4.4 R45.1 U1.5(GND) U4.2(DGND) U4.6(REFN0) U4.10(VREFCOM) U4.21(AVSS) U5.2(GND)
VCC_SENSOR_5V: J1.1 J2.1 J3.1 J4.1
AD1_RST#: C2.1 R2.1 U4.4(~{RESET})
AVDD: C1.1 R1.1 U4.22(AVDD)
CLK_IN: U4.3(CLK) U5.3(OUT)
DRDY1#: U4.25(~{DRDY})
IN1+: C5.2 C6.1 R4.2 U4.11(AIN0)
IN1-: C6.2 C7.1 R5.2 U4.12(AIN1)
IN2+: C8.2 C9.1 R6.2 U4.17(AIN2)
IN2-: C9.2 C10.1 R7.2 U4.18(AIN3)
IN3+: C11.2 C13.1 R8.2 U4.13(AIN4)
IN3-: C13.2 C14.1 R9.2 U4.14(AIN5)
IN4+: C15.2 C16.1 R10.2 U4.15(AIN6)
IN4-: C16.2 C17.1 R11.2 U4.16(AIN7)
SP2_CS1#: U4.24(~{CS})
SP2_MIS0: U4.26(DOUT)
SP2_MOS1: U4.27(DIN)
SP2_SCK: U4.28(SCLK)
START1: U4.23(START)
VREF: Ca0.1 R44.2 U4.5(REFP0)
VREF1: Ca1.1 Ca2.1 R3.1 R44.1 U1.4(VREF)
NetC49_1: C49.1 U4.9(VREFOUT)
NetJ1_2: J1.2 R4.1
NetJ1_3: J1.3 R5.1
NetJ2_2: J2.2 R6.1
NetJ2_3: J2.3 R7.1
NetJ3_2: J3.2 R8.1
NetJ3_3: J3.3 R9.1
NetJ4_2: J4.2 R10.1
NetJ4_3: J4.3 R11.1
NetR45_2: R45.2 U5.1(NC)

Not connected (* = marked no-connect by the designer): U1 1(NC)* 2(GND)* 3(NC)*; U4 7(REFP1) 8(REFN1) 19(IEXC2) 20(IEXC1)

### Notes on the sheet
- 模拟信号输入接口1-4路
- 2015-07-31
- V03
- 9
- 14
- 韦承钢
- 陈益教
- Shen Zhen Strong Technology Co,.LTD
- 深圳市思榕科技有限公司
- Title:
- PN:
- APPD（核准）:
- Date:
- CHK（审核）:
- DR（绘图）:
- Rev:
- Sheet:
- of
- 梁伟

### Library data of the parts
C1 C6 C9 C12 C13 C16 C49 C66 = 电容: Capacitor
  C1 C6 C9 C12 C13 C16 C49: Value: 100nF
  C66: C318: 100NF
C2 C5 C7 C8 C10 C11 C14 C15 C17 = 电容: Capacitor; Value: 100nF
Ca0 Ca2 = CAP
Ca1 = CAP2
J1-J4 = CON4
R1 R2 R4-R11 = RES1
R3 R44 R45 = RES
U1 = LM4030: Voltage adj; Published: 8-Jun-2000; LatestRevisionDate: 29-May-2009; LatestRevisionNote: IPC-7351 Footprint Added.; PackageVersion: Aug-1999; PackageReference: SOT-23B; Publisher: Altium Limited; PackageDescription: 3-Pin SOT-23 Package 0.95 mm Pitch, 2.4 mm Lead Span
U4 = ADS1248IPWR: 24ADC; Part Class: ICS - LOGIC; Mfr Code: TI; Manufacturer: Texas Instruments; Manufacturer Part Num: SN74CBTD3384CDBRE4; DESCRIPTION: IC - 10 BIT FET BUS SWITCH; Item Num: P01-13010R; Num Pins: 24; RoHS Compliant: 1
U5 = ECS-3953C: 贴片晶振; Published: 8-Jun-2000; LatestRevisionDate: 29-May-2009; LatestRevisionNote: IPC-7351 Footprint Added.; PackageVersion: Aug-1999; PackageReference: SOT-23B; Publisher: Altium Limited; PackageDescription: 3-Pin SOT-23 Package 0.95 mm Pitch, 2.4 mm Lead Span

## Sheet 10_AD1.SchDoc
size A4; PageSetup: Record=PageOptions|CenterHorizontal=True|CenterVertical=True|PrintScale=0.97|XCorrection=1.00|YCorrection=1.00|PrintKind=0|BorderSize=5000000|LeftOffset=0|BottomOffset=0|Orientation=2|PaperLength=1000|PaperWidth=1000|Scale=100|PaperSource=7|PrintQuality=-4|MediaType=1|DitherType=10|PaperKind=A4|PrintScaleMode=1
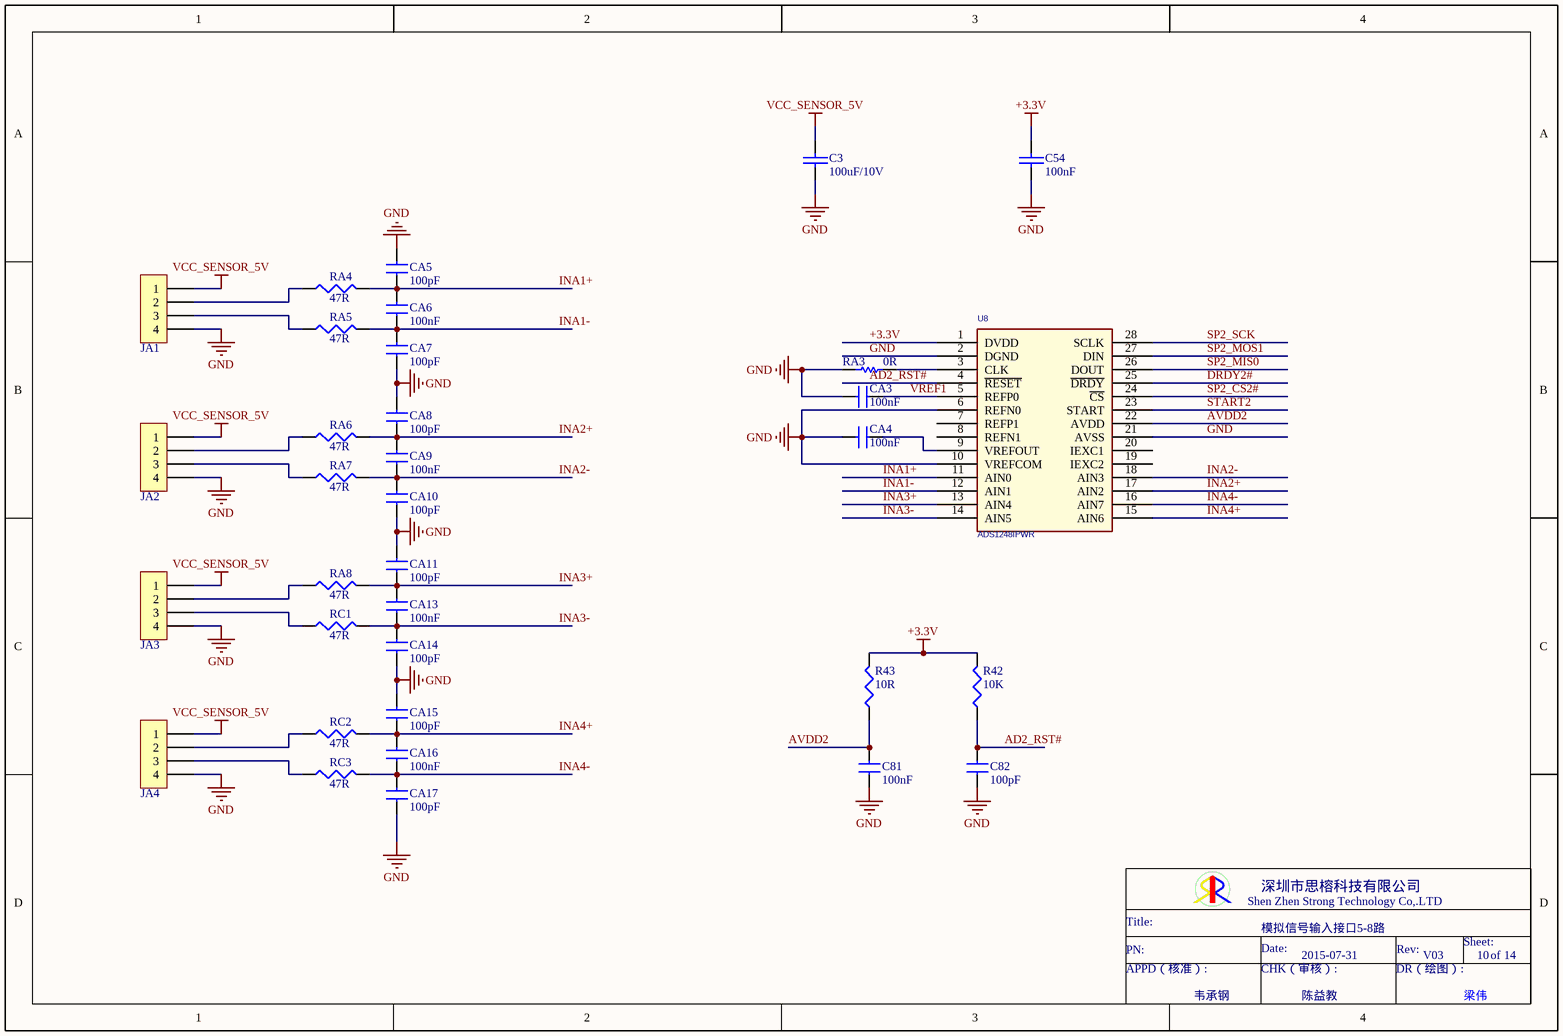
[diagram p9: 10_AD1.SchDoc]

### Parts
C3  100uF/10V  [6032]
C54  100nF  [0603C]
C81  100nF  [0603C]
C82  100pF  [0603C]
CA3  100nF  [0805C]
CA4  100nF  [0805C]
CA5  100pF  [0603C]
CA6  100nF  [0603C]
CA7  100pF  [0603C]
CA8  100pF  [0603C]
CA9  100nF  [0603C]
CA10  100pF  [0603C]
CA11  100pF  [0603C]
CA13  100nF  [0603C]
CA14  100pF  [0603C]
CA15  100pF  [0603C]
CA16  100nF  [0603C]
CA17  100pF  [0603C]
JA1  XH-4A  [CN4-2.54]  (value not drawn)
JA2  XH-4A  [CN4-2.54]  (value not drawn)
JA3  XH-4A  [CN4-2.54]  (value not drawn)
JA4  XH-4A  [CN4-2.54]  (value not drawn)
R42  10K  [0603R]
R43  10R  [0603R]
RA3  0R  [0603R]
RA4  47R  [0603R]
RA5  47R  [0603R]
RA6  47R  [0603R]
RA7  47R  [0603R]
RA8  47R  [0603R]
RC1  47R  [0603R]
RC2  47R  [0603R]
RC3  47R  [0603R]
U8  ADS1248IPWR  [SOIC28]

### Nets
+3.3V: C54.1 R42.2 R43.2 U8.1(DVDD)
GND: C3.2 C54.2 C81.2 C82.2 CA3.2 CA4.2 CA5.1 CA7.2 CA8.1 CA10.2 CA11.1 CA14.2 CA15.1 CA17.2 JA1.4 JA2.4 JA3.4 JA4.4 RA3.1 U8.2(DGND) U8.6(REFN0) U8.10(VREFCOM) U8.21(AVSS)
VCC_SENSOR_5V: C3.1 JA1.1 JA2.1 JA3.1 JA4.1
AD2_RST#: C82.1 R42.1 U8.4(~{RESET})
AVDD2: C81.1 R43.1 U8.22(AVDD)
DRDY2#: U8.25(~{DRDY})
INA1+: CA5.2 CA6.1 RA4.2 U8.11(AIN0)
INA1-: CA6.2 CA7.1 RA5.2 U8.12(AIN1)
INA2+: CA8.2 CA9.1 RA6.2 U8.17(AIN2)
INA2-: CA9.2 CA10.1 RA7.2 U8.18(AIN3)
INA3+: CA11.2 CA13.1 RA8.2 U8.13(AIN4)
INA3-: CA13.2 CA14.1 RC1.2 U8.14(AIN5)
INA4+: CA15.2 CA16.1 RC2.2 U8.15(AIN6)
INA4-: CA16.2 CA17.1 RC3.2 U8.16(AIN7)
SP2_CS2#: U8.24(~{CS})
SP2_MIS0: U8.26(DOUT)
SP2_MOS1: U8.27(DIN)
SP2_SCK: U8.28(SCLK)
START2: U8.23(START)
VREF1: CA3.1 U8.5(REFP0)
NetCA4_1: CA4.1 U8.9(VREFOUT)
NetJA1_2: JA1.2 RA4.1
NetJA1_3: JA1.3 RA5.1
NetJA2_2: JA2.2 RA6.1
NetJA2_3: JA2.3 RA7.1
NetJA3_2: JA3.2 RA8.1
NetJA3_3: JA3.3 RC1.1
NetJA4_2: JA4.2 RC2.1
NetJA4_3: JA4.3 RC3.1
NetRA3_2: RA3.2 U8.3(CLK)

Not connected (* = marked no-connect by the designer): U8 7(REFP1) 8(REFN1) 19(IEXC2) 20(IEXC1)

### Notes on the sheet
- 模拟信号输入接口5-8路
- 2015-07-31
- V03
- 10
- 14
- 韦承钢
- 陈益教
- Shen Zhen Strong Technology Co,.LTD
- 深圳市思榕科技有限公司
- Title:
- PN:
- APPD（核准）:
- Date:
- CHK（审核）:
- DR（绘图）:
- Rev:
- Sheet:
- of
- 梁伟

### Library data of the parts
C3 C54 = CAP: Capacitor
C81 CA3 CA4 CA6 CA9 CA13 CA16 = 电容: Capacitor; Value: 100nF
C82 CA5 CA7 CA8 CA10 CA11 CA14 CA15 CA17 = 电容: Capacitor; Value: 100nF
JA1-JA4 = CON4
R42 R43 RA4-RA8 RC1-RC3 = RES1
RA3 = RES
U8 = ADS1248IPWR: as U4 on sheet 09_AD; RoHS Compliant: 1

## Sheet 11_INPUT.SchDoc
size A4; PageSetup: Record=PageOptions|CenterHorizontal=True|CenterVertical=True|PrintScale=0.97|XCorrection=1.00|YCorrection=1.00|PrintKind=0|BorderSize=5000000|LeftOffset=0|BottomOffset=0|Orientation=2|PaperLength=1000|PaperWidth=1000|Scale=100|PaperSource=7|PrintQuality=-4|MediaType=1|DitherType=10|PaperKind=A4|PrintScaleMode=1
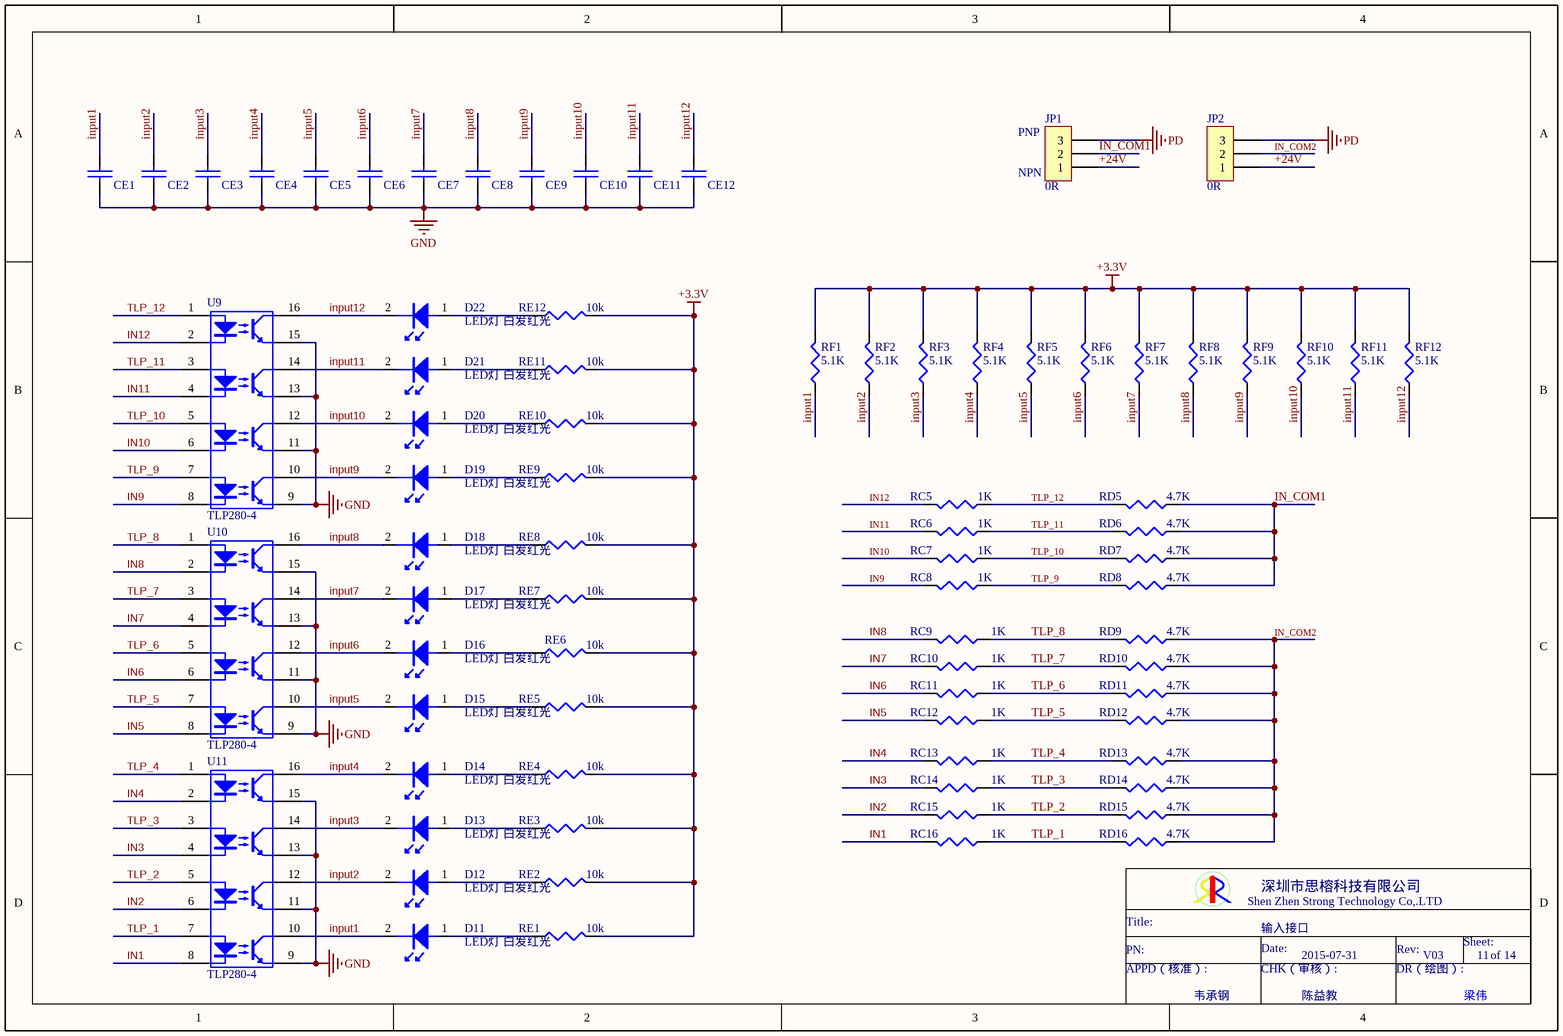
[diagram p10: 11_INPUT.SchDoc]

### Parts
CE1  100pF  [0603C]  (value not drawn)
CE2  100pF  [0603C]  (value not drawn)
CE3  100pF  [0603C]  (value not drawn)
CE4  100pF  [0603C]  (value not drawn)
CE5  100pF  [0603C]  (value not drawn)
CE6  100pF  [0603C]  (value not drawn)
CE7  100pF  [0603C]  (value not drawn)
CE8  100pF  [0603C]  (value not drawn)
CE9  100pF  [0603C]  (value not drawn)
CE10  100pF  [0603C]  (value not drawn)
CE11  100pF  [0603C]  (value not drawn)
CE12  100pF  [0603C]  (value not drawn)
D11  LED灯 白发红光  [D0603]
D12  LED灯 白发红光  [D0603]
D13  LED灯 白发红光  [D0603]
D14  LED灯 白发红光  [D0603]
D15  LED灯 白发红光  [D0603]
D16  LED灯 白发红光  [D0603]
D17  LED灯 白发红光  [D0603]
D18  LED灯 白发红光  [D0603]
D19  LED灯 白发红光  [D0603]
D20  LED灯 白发红光  [D0603]
D21  LED灯 白发红光  [D0603]
D22  LED灯 白发红光  [D0603]
JP1  0R  [3*0.6]
JP2  0R  [3*0.6]
RC5  1K  [0603R]
RC6  1K  [0603R]
RC7  1K  [0603R]
RC8  1K  [0603R]
RC9  1K  [0603R]
RC10  1K  [0603R]
RC11  1K  [0603R]
RC12  1K  [0603R]
RC13  1K  [0603R]
RC14  1K  [0603R]
RC15  1K  [0603R]
RC16  1K  [0603R]
RD5  4.7K  [1206R]
RD6  4.7K  [1206R]
RD7  4.7K  [1206R]
RD8  4.7K  [1206R]
RD9  4.7K  [1206R]
RD10  4.7K  [1206R]
RD11  4.7K  [1206R]
RD12  4.7K  [1206R]
RD13  4.7K  [1206R]
RD14  4.7K  [1206R]
RD15  4.7K  [1206R]
RD16  4.7K  [1206R]
RE1  10k  [0603R]
RE2  10k  [0603R]
RE3  10k  [0603R]
RE4  10k  [0603R]
RE5  10k  [0603R]
RE6  10k  [0603R]
RE7  10k  [0603R]
RE8  10k  [0603R]
RE9  10k  [0603R]
RE10  10k  [0603R]
RE11  10k  [0603R]
RE12  10k  [0603R]
RF1  5.1K  [0603R]
RF2  5.1K  [0603R]
RF3  5.1K  [0603R]
RF4  5.1K  [0603R]
RF5  5.1K  [0603R]
RF6  5.1K  [0603R]
RF7  5.1K  [0603R]
RF8  5.1K  [0603R]
RF9  5.1K  [0603R]
RF10  5.1K  [0603R]
RF11  5.1K  [0603R]
RF12  5.1K  [0603R]
U9  TLP280-4  [SOP16]
U10  TLP280-4  [SOP16]
U11  TLP280-4  [SOP16]

### Nets
+3.3V: RE1.2 RE2.2 RE3.2 RE4.2 RE5.2 RE6.2 RE7.2 RE8.2 RE9.1 RE10.1 RE11.1 RE12.1 RF1.2 RF2.2 RF3.2 RF4.2 RF5.2 RF6.2 RF7.2 RF8.2 RF9.2 RF10.2 RF11.2 RF12.2
+24V: JP1.1 JP2.1
GND: CE1.2 CE2.2 CE3.2 CE4.2 CE5.2 CE6.2 CE7.2 CE8.2 CE9.2 CE10.2 CE11.2 CE12.2 U9.9(Emitter) U9.11(Emitter) U9.13(Emitter) U9.15(Emitter) U10.9(Emitter) U10.11(Emitter) U10.13(Emitter) U10.15(Emitter) U11.9(Emitter) U11.11(Emitter) U11.13(Emitter) U11.15(Emitter)
PD: JP1.3 JP2.3
IN1: RC16.2 U11.8(LED_Cathode)
IN2: RC15.2 U11.6(LED_Cathode)
IN3: RC14.2 U11.4(LED_Cathode)
IN4: RC13.2 U11.2(LED_Cathode)
IN5: RC12.2 U10.8(LED_Cathode)
IN6: RC11.2 U10.6(LED_Cathode)
IN7: RC10.2 U10.4(LED_Cathode)
IN8: RC9.2 U10.2(LED_Cathode)
IN9: RC8.2 U9.8(LED_Cathode)
IN10: RC7.2 U9.6(LED_Cathode)
IN11: RC6.2 U9.4(LED_Cathode)
IN12: RC5.2 U9.2(LED_Cathode)
IN_COM1: JP1.2 RD5.1 RD6.1 RD7.1 RD8.1
IN_COM2: JP2.2 RD9.1 RD10.1 RD11.1 RD12.1 RD13.1 RD14.1 RD15.1 RD16.1
INPUT1: CE1.1 D11.2 RF1.1 U11.10(Collector)
INPUT2: CE2.1 D12.2 RF2.1 U11.12(Collector)
INPUT3: CE3.1 D13.2 RF3.1 U11.14(Collector)
INPUT4: CE4.1 D14.2 RF4.1 U11.16(Collector)
INPUT5: CE5.1 D15.2 RF5.1 U10.10(Collector)
INPUT6: CE6.1 D16.2 RF6.1 U10.12(Collector)
INPUT7: CE7.1 D17.2 RF7.1 U10.14(Collector)
INPUT8: CE8.1 D18.2 RF8.1 U10.16(Collector)
INPUT9: CE9.1 D19.2 RF9.1 U9.10(Collector)
INPUT10: CE10.1 D20.2 RF10.1 U9.12(Collector)
INPUT11: CE11.1 D21.2 RF11.1 U9.14(Collector)
INPUT12: CE12.1 D22.2 RF12.1 U9.16(Collector)
TLP_1: RC16.1 RD16.2 U11.7(LED_Anode)
TLP_2: RC15.1 RD15.2 U11.5(LED_Anode)
TLP_3: RC14.1 RD14.2 U11.3(LED_Anode)
TLP_4: RC13.1 RD13.2 U11.1(LED_Anode)
TLP_5: RC12.1 RD12.2 U10.7(LED_Anode)
TLP_6: RC11.1 RD11.2 U10.5(LED_Anode)
TLP_7: RC10.1 RD10.2 U10.3(LED_Anode)
TLP_8: RC9.1 RD9.2 U10.1(LED_Anode)
TLP_9: RC8.1 RD8.2 U9.7(LED_Anode)
TLP_10: RC7.1 RD7.2 U9.5(LED_Anode)
TLP_11: RC6.1 RD6.2 U9.3(LED_Anode)
TLP_12: RC5.1 RD5.2 U9.1(LED_Anode)
NetD11_1: D11.1 RE1.1
NetD12_1: D12.1 RE2.1
NetD13_1: D13.1 RE3.1
NetD14_1: D14.1 RE4.1
NetD15_1: D15.1 RE5.1
NetD16_1: D16.1 RE6.1
NetD17_1: D17.1 RE7.1
NetD18_1: D18.1 RE8.1
NetD19_1: D19.1 RE9.2
NetD20_1: D20.1 RE10.2
NetD21_1: D21.1 RE11.2
NetD22_1: D22.1 RE12.2

### Notes on the sheet
- (near JP1) NPN
- (near JP1) PNP
- 输入接口
- 2015-07-31
- V03
- 11
- 14
- 韦承钢
- 陈益教
- Shen Zhen Strong Technology Co,.LTD
- 深圳市思榕科技有限公司
- Title:
- PN:
- APPD（核准）:
- Date:
- CHK（审核）:
- DR（绘图）:
- Rev:
- Sheet:
- of
- 梁伟

### Library data of the parts
CE1-CE12 = CAP: Capacitor
D11-D22 = LED: LED灯
JP1 JP2 = CON3: Connector
RC5-RC16 RD5-RD16 RE1-RE12 RF1-RF12 = RES1

## Sheet 12_OUT.SchDoc
size A4; Date: 10; PageSetup: Record=PageOptions|CenterHorizontal=True|CenterVertical=True|PrintScale=0.97|XCorrection=1.00|YCorrection=1.00|PrintKind=0|BorderSize=5000000|LeftOffset=0|BottomOffset=0|Orientation=2|PaperLength=1000|PaperWidth=1000|Scale=100|PaperSource=7|PrintQuality=-4|MediaType=1|DitherType=10|PaperKind=A4|PrintScaleMode=1
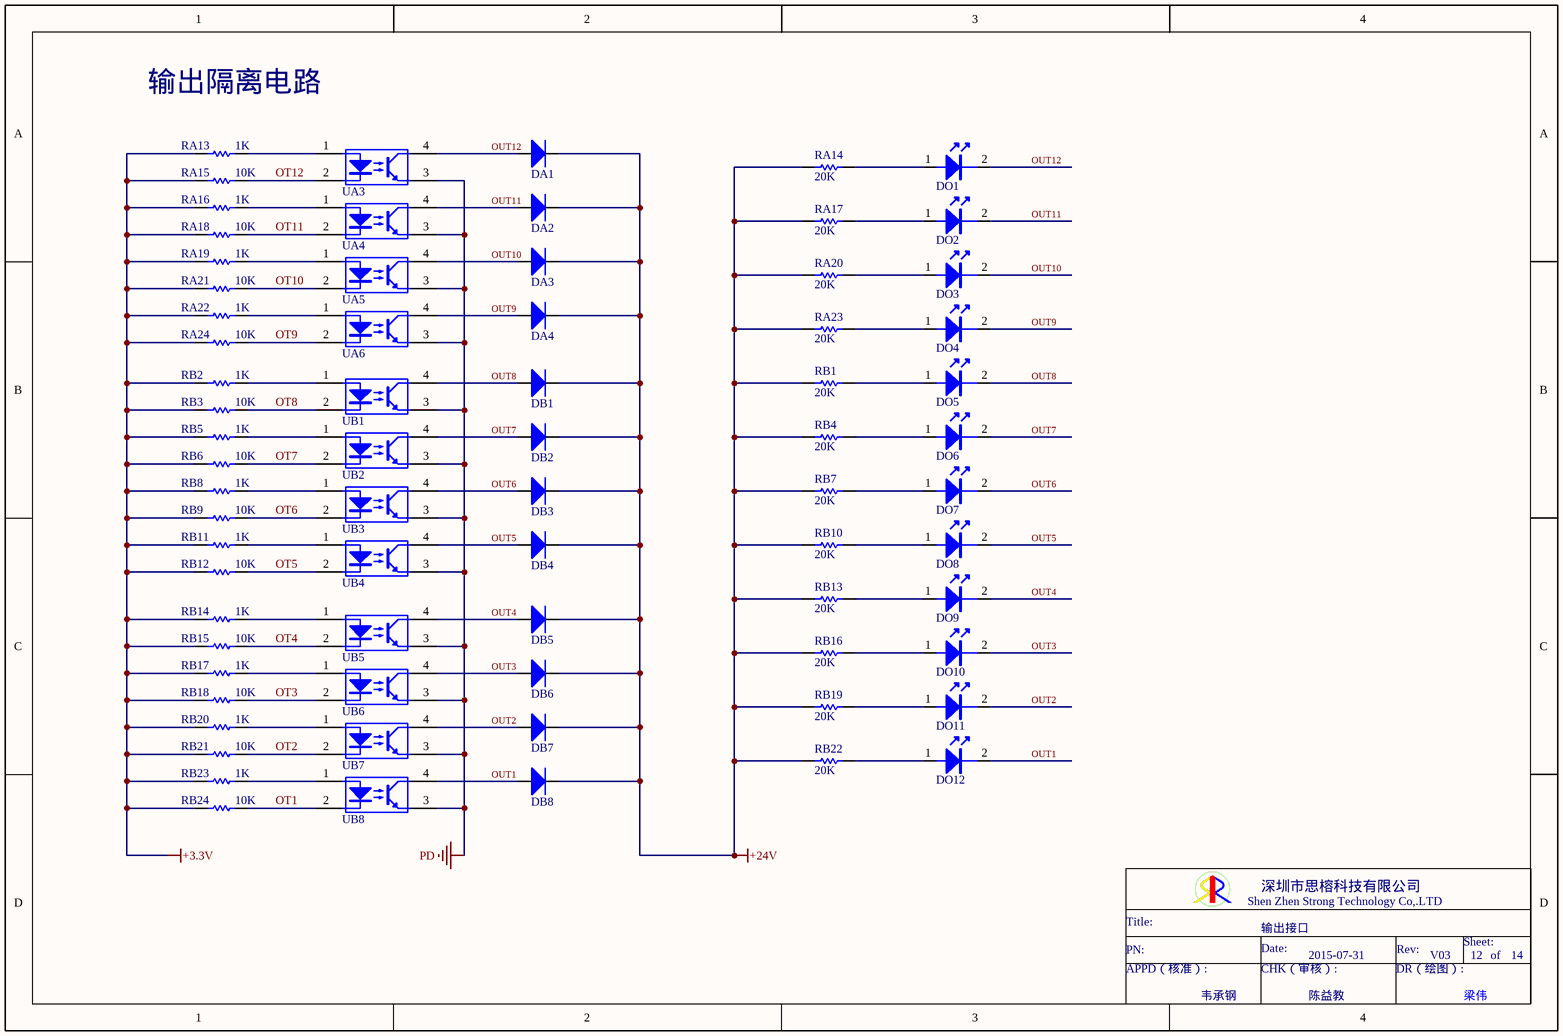
[diagram p11: 12_OUT.SchDoc]

### Parts
DA1  IN4148W T4  [1206D]  (value not drawn)
DA2  IN4148W T4  [1206D]  (value not drawn)
DA3  IN4148W T4  [1206D]  (value not drawn)
DA4  IN4148W T4  [1206D]  (value not drawn)
DB1  IN4148W T4  [1206D]  (value not drawn)
DB2  IN4148W T4  [1206D]  (value not drawn)
DB3  IN4148W T4  [1206D]  (value not drawn)
DB4  IN4148W T4  [1206D]  (value not drawn)
DB5  IN4148W T4  [1206D]  (value not drawn)
DB6  IN4148W T4  [1206D]  (value not drawn)
DB7  IN4148W T4  [1206D]  (value not drawn)
DB8  IN4148W T4  [1206D]  (value not drawn)
DO1  LED灯 白发红光  [D0603]  (value not drawn)
DO2  LED灯 白发红光  [D0603]  (value not drawn)
DO3  LED灯 白发红光  [D0603]  (value not drawn)
DO4  LED灯 白发红光  [D0603]  (value not drawn)
DO5  LED灯 白发红光  [D0603]  (value not drawn)
DO6  LED灯 白发红光  [D0603]  (value not drawn)
DO7  LED灯 白发红光  [D0603]  (value not drawn)
DO8  LED灯 白发红光  [D0603]  (value not drawn)
DO9  LED灯 白发红光  [D0603]  (value not drawn)
DO10  LED灯 白发红光  [D0603]  (value not drawn)
DO11  LED灯 白发红光  [D0603]  (value not drawn)
DO12  LED灯 白发红光  [D0603]  (value not drawn)
RA13  1K  [0603R]
RA14  20K  [0603R]
RA15  10K  [0603R]
RA16  1K  [0603R]
RA17  20K  [0603R]
RA18  10K  [0603R]
RA19  1K  [0603R]
RA20  20K  [0603R]
RA21  10K  [0603R]
RA22  1K  [0603R]
RA23  20K  [0603R]
RA24  10K  [0603R]
RB1  20K  [0603R]
RB2  1K  [0603R]
RB3  10K  [0603R]
RB4  20K  [0603R]
RB5  1K  [0603R]
RB6  10K  [0603R]
RB7  20K  [0603R]
RB8  1K  [0603R]
RB9  10K  [0603R]
RB10  20K  [0603R]
RB11  1K  [0603R]
RB12  10K  [0603R]
RB13  20K  [0603R]
RB14  1K  [0603R]
RB15  10K  [0603R]
RB16  20K  [0603R]
RB17  1K  [0603R]
RB18  10K  [0603R]
RB19  20K  [0603R]
RB20  1K  [0603R]
RB21  10K  [0603R]
RB22  20K  [0603R]
RB23  1K  [0603R]
RB24  10K  [0603R]
UA3  AQY212GS  [SOP4-2.54]  (value not drawn)
UA4  AQY212GS  [SOP4-2.54]  (value not drawn)
UA5  AQY212GS  [SOP4-2.54]  (value not drawn)
UA6  AQY212GS  [SOP4-2.54]  (value not drawn)
UB1  AQY212GS  [SOP4-2.54]  (value not drawn)
UB2  AQY212GS  [SOP4-2.54]  (value not drawn)
UB3  AQY212GS  [SOP4-2.54]  (value not drawn)
UB4  AQY212GS  [SOP4-2.54]  (value not drawn)
UB5  AQY212GS  [SOP4-2.54]  (value not drawn)
UB6  AQY212GS  [SOP4-2.54]  (value not drawn)
UB7  AQY212GS  [SOP4-2.54]  (value not drawn)
UB8  AQY212GS  [SOP4-2.54]  (value not drawn)

### Nets
+3.3V: RA13.1 RA15.1 RA16.1 RA18.1 RA19.1 RA21.1 RA22.1 RA24.1 RB2.1 RB3.1 RB5.1 RB6.1 RB8.1 RB9.1 RB11.1 RB12.1 RB14.1 RB15.1 RB17.1 RB18.1 RB20.1 RB21.1 RB23.1 RB24.1
+24V: DA1.2 DA2.2 DA3.2 DA4.2 DB1.2 DB2.2 DB3.2 DB4.2 DB5.2 DB6.2 DB7.2 DB8.2 RA14.1 RA17.1 RA20.1 RA23.1 RB1.1 RB4.1 RB7.1 RB10.1 RB13.1 RB16.1 RB19.1 RB22.1
PD: UA3.3(Emitter) UA4.3(Emitter) UA5.3(Emitter) UA6.3(Emitter) UB1.3(Emitter) UB2.3(Emitter) UB3.3(Emitter) UB4.3(Emitter) UB5.3(Emitter) UB6.3(Emitter) UB7.3(Emitter) UB8.3(Emitter)
OT1: RB24.2 UB8.2(LED_Cathode)
OT2: RB21.2 UB7.2(LED_Cathode)
OT3: RB18.2 UB6.2(LED_Cathode)
OT4: RB15.2 UB5.2(LED_Cathode)
OT5: RB12.2 UB4.2(LED_Cathode)
OT6: RB9.2 UB3.2(LED_Cathode)
OT7: RB6.2 UB2.2(LED_Cathode)
OT8: RB3.2 UB1.2(LED_Cathode)
OT9: RA24.2 UA6.2(LED_Cathode)
OT10: RA21.2 UA5.2(LED_Cathode)
OT11: RA18.2 UA4.2(LED_Cathode)
OT12: RA15.2 UA3.2(LED_Cathode)
OUT1: DB8.1 DO12.2 UB8.4(Collector)
OUT2: DB7.1 DO11.2 UB7.4(Collector)
OUT3: DB6.1 DO10.2 UB6.4(Collector)
OUT4: DB5.1 DO9.2 UB5.4(Collector)
OUT5: DB4.1 DO8.2 UB4.4(Collector)
OUT6: DB3.1 DO7.2 UB3.4(Collector)
OUT7: DB2.1 DO6.2 UB2.4(Collector)
OUT8: DB1.1 DO5.2 UB1.4(Collector)
OUT9: DA4.1 DO4.2 UA6.4(Collector)
OUT10: DA3.1 DO3.2 UA5.4(Collector)
OUT11: DA2.1 DO2.2 UA4.4(Collector)
OUT12: DA1.1 DO1.2 UA3.4(Collector)
NetDO1_1: DO1.1 RA14.2
NetDO2_1: DO2.1 RA17.2
NetDO3_1: DO3.1 RA20.2
NetDO4_1: DO4.1 RA23.2
NetDO5_1: DO5.1 RB1.2
NetDO6_1: DO6.1 RB4.2
NetDO7_1: DO7.1 RB7.2
NetDO8_1: DO8.1 RB10.2
NetDO9_1: DO9.1 RB13.2
NetDO10_1: DO10.1 RB16.2
NetDO11_1: DO11.1 RB19.2
NetDO12_1: DO12.1 RB22.2
NetRA13_2: RA13.2 UA3.1(LED_Anode)
NetRA16_2: RA16.2 UA4.1(LED_Anode)
NetRA19_2: RA19.2 UA5.1(LED_Anode)
NetRA22_2: RA22.2 UA6.1(LED_Anode)
NetRB2_2: RB2.2 UB1.1(LED_Anode)
NetRB5_2: RB5.2 UB2.1(LED_Anode)
NetRB8_2: RB8.2 UB3.1(LED_Anode)
NetRB11_2: RB11.2 UB4.1(LED_Anode)
NetRB14_2: RB14.2 UB5.1(LED_Anode)
NetRB17_2: RB17.2 UB6.1(LED_Anode)
NetRB20_2: RB20.2 UB7.1(LED_Anode)
NetRB23_2: RB23.2 UB8.1(LED_Anode)

### Notes on the sheet
- 输出隔离电路
- 输出接口
- 2015-07-31
- V03
- 12
- 14
- 韦承钢
- 陈益教
- Shen Zhen Strong Technology Co,.LTD
- 深圳市思榕科技有限公司
- Title:
- PN:
- APPD（核准）:
- Date:
- CHK（审核）:
- DR（绘图）:
- Rev:
- Sheet:
- of
- 梁伟

### Library data of the parts
DA1-DA4 DB1-DB8 = D: 二极管
DO1-DO12 = LED: LED灯
RA13-RA24 RB1-RB24 = RES
UA3-UA6 UB1-UB8 = TLP281

## Sheet 13_EEPROM_SW_JTAG.SchDoc
size A4; PageSetup: Record=PageOptions|CenterHorizontal=True|CenterVertical=True|PrintScale=0.97|XCorrection=1.00|YCorrection=1.00|PrintKind=0|BorderSize=5000000|LeftOffset=0|BottomOffset=0|Orientation=2|PaperLength=1000|PaperWidth=1000|Scale=100|PaperSource=7|PrintQuality=-4|MediaType=1|DitherType=10|PaperKind=A4|PrintScaleMode=1
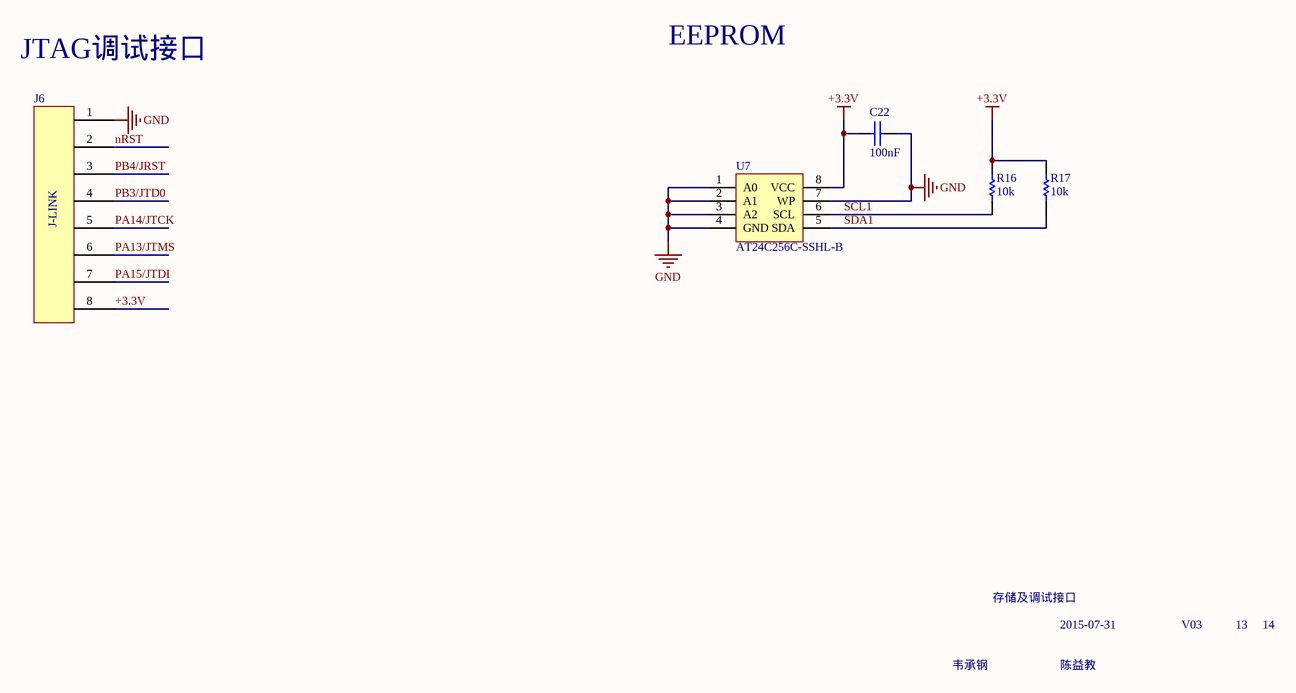
[diagram p12: 13_EEPROM_SW_JTAG.SchDoc]

### Parts
C22  100nF  [0603C]
J6  J-LINK  [JA4/2/3]
R16  10k  [0603R]
R17  10k  [0603R]
U7  AT24C256C-SSHL-B  [SOP8]

### Nets
+3.3V: C22.1 J6.8 R16.2 R17.2 U7.8(VCC)
GND: C22.2 J6.1 U7.1(A0) U7.2(A1) U7.3(A2) U7.4(GND) U7.7(WP)
nRST: J6.2
PA13/JTMS: J6.6
PA14/JTCK: J6.5
PA15/JTDI: J6.7
PB3/JTD0: J6.4
PB4/JRST: J6.3
SCL1: R16.1 U7.6(SCL)
SDA1: R17.1 U7.5(SDA)

### Notes on the sheet
- EEPROM
- JTAG调试接口
- 存储及调试接口
- 2015-07-31
- V03
- 13
- 14
- 韦承钢
- 陈益教
- Shen Zhen Strong Technology Co,.LTD
- 深圳市思榕科技有限公司
- Title:
- PN:
- APPD（核准）:
- Date:
- CHK（审核）:
- DR（绘图）:
- Rev:
- Sheet:
- of
- 梁伟

### Library data of the parts
C22 = CAP
J6 = COM8
R16 R17 = RES
U7 = 24CXX

## Sheet 14_CONNECTOR.SchDoc
size A4; PageSetup: Record=PageOptions|CenterHorizontal=True|CenterVertical=True|PrintScale=0.97|XCorrection=1.00|YCorrection=1.00|PrintKind=0|BorderSize=5000000|LeftOffset=0|BottomOffset=0|Orientation=2|PaperLength=1000|PaperWidth=1000|Scale=100|PaperSource=7|PrintQuality=-4|MediaType=1|DitherType=10|PaperKind=A4|PrintScaleMode=1
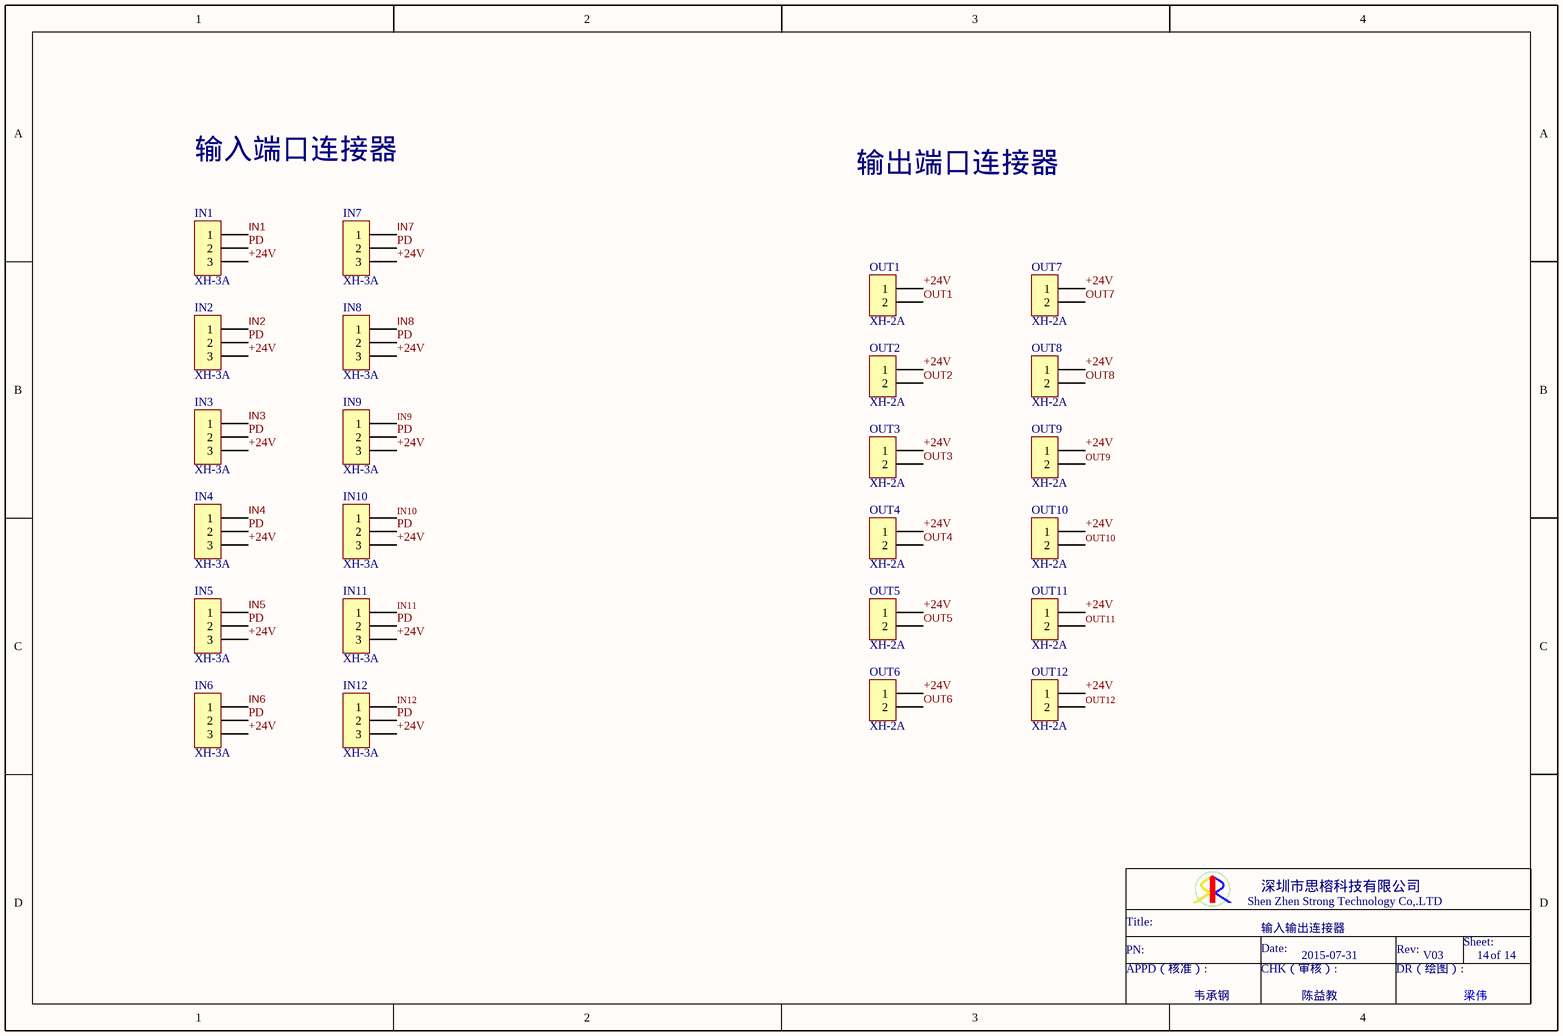
[diagram p13: 14_CONNECTOR.SchDoc]

### Parts
IN1  XH-3A  [CN3-2.54]
IN2  XH-3A  [CN3-2.54]
IN3  XH-3A  [CN3-2.54]
IN4  XH-3A  [CN3-2.54]
IN5  XH-3A  [CN3-2.54]
IN6  XH-3A  [CN3-2.54]
IN7  XH-3A  [CN3-2.54]
IN8  XH-3A  [CN3-2.54]
IN9  XH-3A  [CN3-2.54]
IN10  XH-3A  [CN3-2.54]
IN11  XH-3A  [CN3-2.54]
IN12  XH-3A  [CN3-2.54]
OUT1  XH-2A  [CN2-2.54]
OUT2  XH-2A  [CN2-2.54]
OUT3  XH-2A  [CN2-2.54]
OUT4  XH-2A  [CN2-2.54]
OUT5  XH-2A  [CN2-2.54]
OUT6  XH-2A  [CN2-2.54]
OUT7  XH-2A  [CN2-2.54]
OUT8  XH-2A  [CN2-2.54]
OUT9  XH-2A  [CN2-2.54]
OUT10  XH-2A  [CN2-2.54]
OUT11  XH-2A  [CN2-2.54]
OUT12  XH-2A  [CN2-2.54]

### Nets
+24V: IN1.3 IN2.3 IN3.3 IN4.3 IN5.3 IN6.3 IN7.3 IN8.3 IN9.3 IN10.3 IN11.3 IN12.3 OUT1.1 OUT2.1 OUT3.1 OUT4.1 OUT5.1 OUT6.1 OUT7.1 OUT8.1 OUT9.1 OUT10.1 OUT11.1 OUT12.1
PD: IN1.2 IN2.2 IN3.2 IN4.2 IN5.2 IN6.2 IN7.2 IN8.2 IN9.2 IN10.2 IN11.2 IN12.2
IN1: IN1.1
IN2: IN2.1
IN3: IN3.1
IN4: IN4.1
IN5: IN5.1
IN6: IN6.1
IN7: IN7.1
IN8: IN8.1
IN9: IN9.1
IN10: IN10.1
IN11: IN11.1
IN12: IN12.1
OUT1: OUT1.2
OUT2: OUT2.2
OUT3: OUT3.2
OUT4: OUT4.2
OUT5: OUT5.2
OUT6: OUT6.2
OUT7: OUT7.2
OUT8: OUT8.2
OUT9: OUT9.2
OUT10: OUT10.2
OUT11: OUT11.2
OUT12: OUT12.2

### Notes on the sheet
- 输入端口连接器
- 输出端口连接器
- 输入输出连接器
- 2015-07-31
- V03
- 14
- 韦承钢
- 陈益教
- Shen Zhen Strong Technology Co,.LTD
- 深圳市思榕科技有限公司
- Title:
- PN:
- APPD（核准）:
- Date:
- CHK（审核）:
- DR（绘图）:
- Rev:
- Sheet:
- of
- 梁伟

### Library data of the parts
IN1-IN12 = CON3
OUT1-OUT12 = CON2

## Nets that join several sheets
+3.3V: 01_POWER (C23.2 E2.1 U14.2), 02_MCU (15 pins), 03_USART (C59.2 U21.8), 04_SCAN (C53.2 U23.8), 05_SD_USB (7 pins), 06_SENSOR (R37.1 R38.1), 07_MOTOR (6 pins), 08_DC_DC (5 pins), 09_AD (7 pins), 10_AD1 (C54.1 R42.2 R43.2 U8.1), 11_INPUT (24 pins), 12_OUT (24 pins), 13_EEPROM_SW_JTAG (5 pins)
+5V: 01_POWER (6 pins), 05_SD_USB (D37.2 J9.1)
+24V: 01_POWER (6 pins), 11_INPUT (JP1.1 JP2.1), 12_OUT (24 pins), 14_CONNECTOR (24 pins)
GND: 01_POWER (9 pins), 02_MCU (18 pins), 03_USART (C59.1 U21.5), 04_SCAN (C53.1 U23.5), 05_SD_USB (21 pins), 06_SENSOR (CE13.2 U16.3), 07_MOTOR (C34.1 U13.4), 08_DC_DC (10 pins), 09_AD (27 pins), 10_AD1 (23 pins), 11_INPUT (24 pins), 13_EEPROM_SW_JTAG (7 pins)
PD: 01_POWER (14 pins), 03_USART (9 pins), 04_SCAN (7 pins), 06_SENSOR (5 pins), 07_MOTOR (9 pins), 11_INPUT (JP1.3 JP2.3), 12_OUT (12 pins), 14_CONNECTOR (12 pins)
VCC2: 01_POWER (6 pins), 03_USART (5 pins), 04_SCAN (C52.1 C69.1 U22.16 U23.1), 06_SENSOR (5 pins), 07_MOTOR (5 pins)
VCC_SENSOR_5V: 08_DC_DC (C4.1 E4.1 L2.2), 09_AD (J1.1 J2.1 J3.1 J4.1), 10_AD1 (5 pins)
AD1_RST#: 02_MCU (U12.59), 09_AD (C2.1 R2.1 U4.4)
AD2_RST#: 02_MCU (U12.46), 10_AD1 (C82.1 R42.1 U8.4)
DRDY1#: 02_MCU (U12.56), 09_AD (U4.25)
DRDY2#: 02_MCU (U12.51), 10_AD1 (U8.25)
IN1: 11_INPUT (RC16.2 U11.8), 14_CONNECTOR (IN1.1)
IN2: 11_INPUT (RC15.2 U11.6), 14_CONNECTOR (IN2.1)
IN3: 11_INPUT (RC14.2 U11.4), 14_CONNECTOR (IN3.1)
IN4: 11_INPUT (RC13.2 U11.2), 14_CONNECTOR (IN4.1)
IN5: 11_INPUT (RC12.2 U10.8), 14_CONNECTOR (IN5.1)
IN6: 11_INPUT (RC11.2 U10.6), 14_CONNECTOR (IN6.1)
IN7: 11_INPUT (RC10.2 U10.4), 14_CONNECTOR (IN7.1)
IN8: 11_INPUT (RC9.2 U10.2), 14_CONNECTOR (IN8.1)
IN9: 11_INPUT (RC8.2 U9.8), 14_CONNECTOR (IN9.1)
IN10: 11_INPUT (RC7.2 U9.6), 14_CONNECTOR (IN10.1)
IN11: 11_INPUT (RC6.2 U9.4), 14_CONNECTOR (IN11.1)
IN12: 11_INPUT (RC5.2 U9.2), 14_CONNECTOR (IN12.1)
INPUT1: 02_MCU (U12.5), 11_INPUT (CE1.1 D11.2 RF1.1 U11.10)
INPUT2: 02_MCU (U12.4), 11_INPUT (CE2.1 D12.2 RF2.1 U11.12)
INPUT3: 02_MCU (U12.3), 11_INPUT (CE3.1 D13.2 RF3.1 U11.14)
INPUT4: 02_MCU (U12.2), 11_INPUT (CE4.1 D14.2 RF4.1 U11.16)
INPUT5: 02_MCU (U12.1), 11_INPUT (CE5.1 D15.2 RF5.1 U10.10)
INPUT6: 02_MCU (U12.98), 11_INPUT (CE6.1 D16.2 RF6.1 U10.12)
INPUT7: 02_MCU (U12.97), 11_INPUT (CE7.1 D17.2 RF7.1 U10.14)
INPUT8: 02_MCU (U12.96), 11_INPUT (CE8.1 D18.2 RF8.1 U10.16)
INPUT9: 02_MCU (U12.91), 11_INPUT (CE9.1 D19.2 RF9.1 U9.10)
INPUT10: 02_MCU (U12.86), 11_INPUT (CE10.1 D20.2 RF10.1 U9.12)
INPUT11: 02_MCU (U12.85), 11_INPUT (CE11.1 D21.2 RF11.1 U9.14)
INPUT12: 02_MCU (U12.84), 11_INPUT (CE12.1 D22.2 RF12.1 U9.16)
INPUT13: 02_MCU (U12.83), 06_SENSOR (CE13.1 D23.2 R38.2 U16.4)
nRST: 02_MCU (C33.1 R20.1 U12.14), 13_EEPROM_SW_JTAG (J6.2)
OT1: 02_MCU (U12.34), 12_OUT (RB24.2 UB8.2)
OT2: 02_MCU (U12.35), 12_OUT (RB21.2 UB7.2)
OT3: 02_MCU (U12.36), 12_OUT (RB18.2 UB6.2)
OT4: 02_MCU (U12.37), 12_OUT (RB15.2 UB5.2)
OT5: 02_MCU (U12.38), 12_OUT (RB12.2 UB4.2)
OT6: 02_MCU (U12.39), 12_OUT (RB9.2 UB3.2)
OT7: 02_MCU (U12.40), 12_OUT (RB6.2 UB2.2)
OT8: 02_MCU (U12.41), 12_OUT (RB3.2 UB1.2)
OT9: 02_MCU (U12.42), 12_OUT (RA24.2 UA6.2)
OT10: 02_MCU (U12.43), 12_OUT (RA21.2 UA5.2)
OT11: 02_MCU (U12.44), 12_OUT (RA18.2 UA4.2)
OT12: 02_MCU (U12.45), 12_OUT (RA15.2 UA3.2)
OT20: 02_MCU (U12.61), 07_MOTOR (RG2.2 UA1.2)
OT21: 02_MCU (U12.62), 07_MOTOR (RA12.2 UA2.2)
OUT1: 12_OUT (DB8.1 DO12.2 UB8.4), 14_CONNECTOR (OUT1.2)
OUT2: 12_OUT (DB7.1 DO11.2 UB7.4), 14_CONNECTOR (OUT2.2)
OUT3: 12_OUT (DB6.1 DO10.2 UB6.4), 14_CONNECTOR (OUT3.2)
OUT4: 12_OUT (DB5.1 DO9.2 UB5.4), 14_CONNECTOR (OUT4.2)
OUT5: 12_OUT (DB4.1 DO8.2 UB4.4), 14_CONNECTOR (OUT5.2)
OUT6: 12_OUT (DB3.1 DO7.2 UB3.4), 14_CONNECTOR (OUT6.2)
OUT7: 12_OUT (DB2.1 DO6.2 UB2.4), 14_CONNECTOR (OUT7.2)
OUT8: 12_OUT (DB1.1 DO5.2 UB1.4), 14_CONNECTOR (OUT8.2)
OUT9: 12_OUT (DA4.1 DO4.2 UA6.4), 14_CONNECTOR (OUT9.2)
OUT10: 12_OUT (DA3.1 DO3.2 UA5.4), 14_CONNECTOR (OUT10.2)
OUT11: 12_OUT (DA2.1 DO2.2 UA4.4), 14_CONNECTOR (OUT11.2)
OUT12: 12_OUT (DA1.1 DO1.2 UA3.4), 14_CONNECTOR (OUT12.2)
PA13/JTMS: 02_MCU (U12.72), 13_EEPROM_SW_JTAG (J6.6)
PA14/JTCK: 02_MCU (U12.76), 13_EEPROM_SW_JTAG (J6.5)
PA15/JTDI: 02_MCU (U12.77), 13_EEPROM_SW_JTAG (J6.7)
PB3/JTD0: 02_MCU (U12.89), 13_EEPROM_SW_JTAG (J6.4)
PB4/JRST: 02_MCU (U12.90), 13_EEPROM_SW_JTAG (J6.3)
PWM1: 02_MCU (U12.95), 07_MOTOR (U13.2)
PWM2: 02_MCU (U12.67), 07_MOTOR (U13.3)
RXD1: 02_MCU (U12.69), 03_USART (U21.6)
RXD2: 02_MCU (U12.26), 05_SD_USB (U18.5)
RXD4: 02_MCU (U12.79), 04_SCAN (U23.6)
SCL1: 02_MCU (U12.92), 13_EEPROM_SW_JTAG (R16.1 U7.6)
SD_INT#: 02_MCU (U12.33), 05_SD_USB (U18.1)
SDA1: 02_MCU (U12.93), 13_EEPROM_SW_JTAG (R17.1 U7.5)
SP1_CS#: 02_MCU (U12.29), 05_SD_USB (U18.18)
SP1_MIS0: 02_MCU (U12.31), 05_SD_USB (U18.22)
SP1_MOS1: 02_MCU (U12.32), 05_SD_USB (U18.21)
SP1_SCK: 02_MCU (U12.30), 05_SD_USB (U18.20)
SP2_CS1#: 02_MCU (U12.57), 09_AD (U4.24)
SP2_CS2#: 02_MCU (U12.48), 10_AD1 (U8.24)
SP2_MIS0: 02_MCU (U12.53), 09_AD (U4.26), 10_AD1 (U8.26)
SP2_MOS1: 02_MCU (U12.54), 09_AD (U4.27), 10_AD1 (U8.27)
SP2_SCK: 02_MCU (U12.52), 09_AD (U4.28), 10_AD1 (U8.28)
START1: 02_MCU (U12.58), 09_AD (U4.23)
START2: 02_MCU (U12.47), 10_AD1 (U8.23)
TXD1: 02_MCU (U12.68), 03_USART (U21.7)
TXD2: 02_MCU (U12.25), 05_SD_USB (U18.6)
TXD4: 02_MCU (U12.78), 04_SCAN (U23.7)
USB_ENABLE: 02_MCU (U12.24), 05_SD_USB (R40.2 U19.1)
USB_V_IN: 02_MCU (U12.18), 05_SD_USB (R31.2 R49.1)
VREF1: 09_AD (5 pins), 10_AD1 (CA3.1 U8.5)